# Altium project BEE-DAL_EXP_V1.0.PrjPcb (part 2 of 2)

## Sheet 15_HD_PUMP.SchDoc
size 420 x 297 mm; SheetNumber: 15; SheetTotal: 27
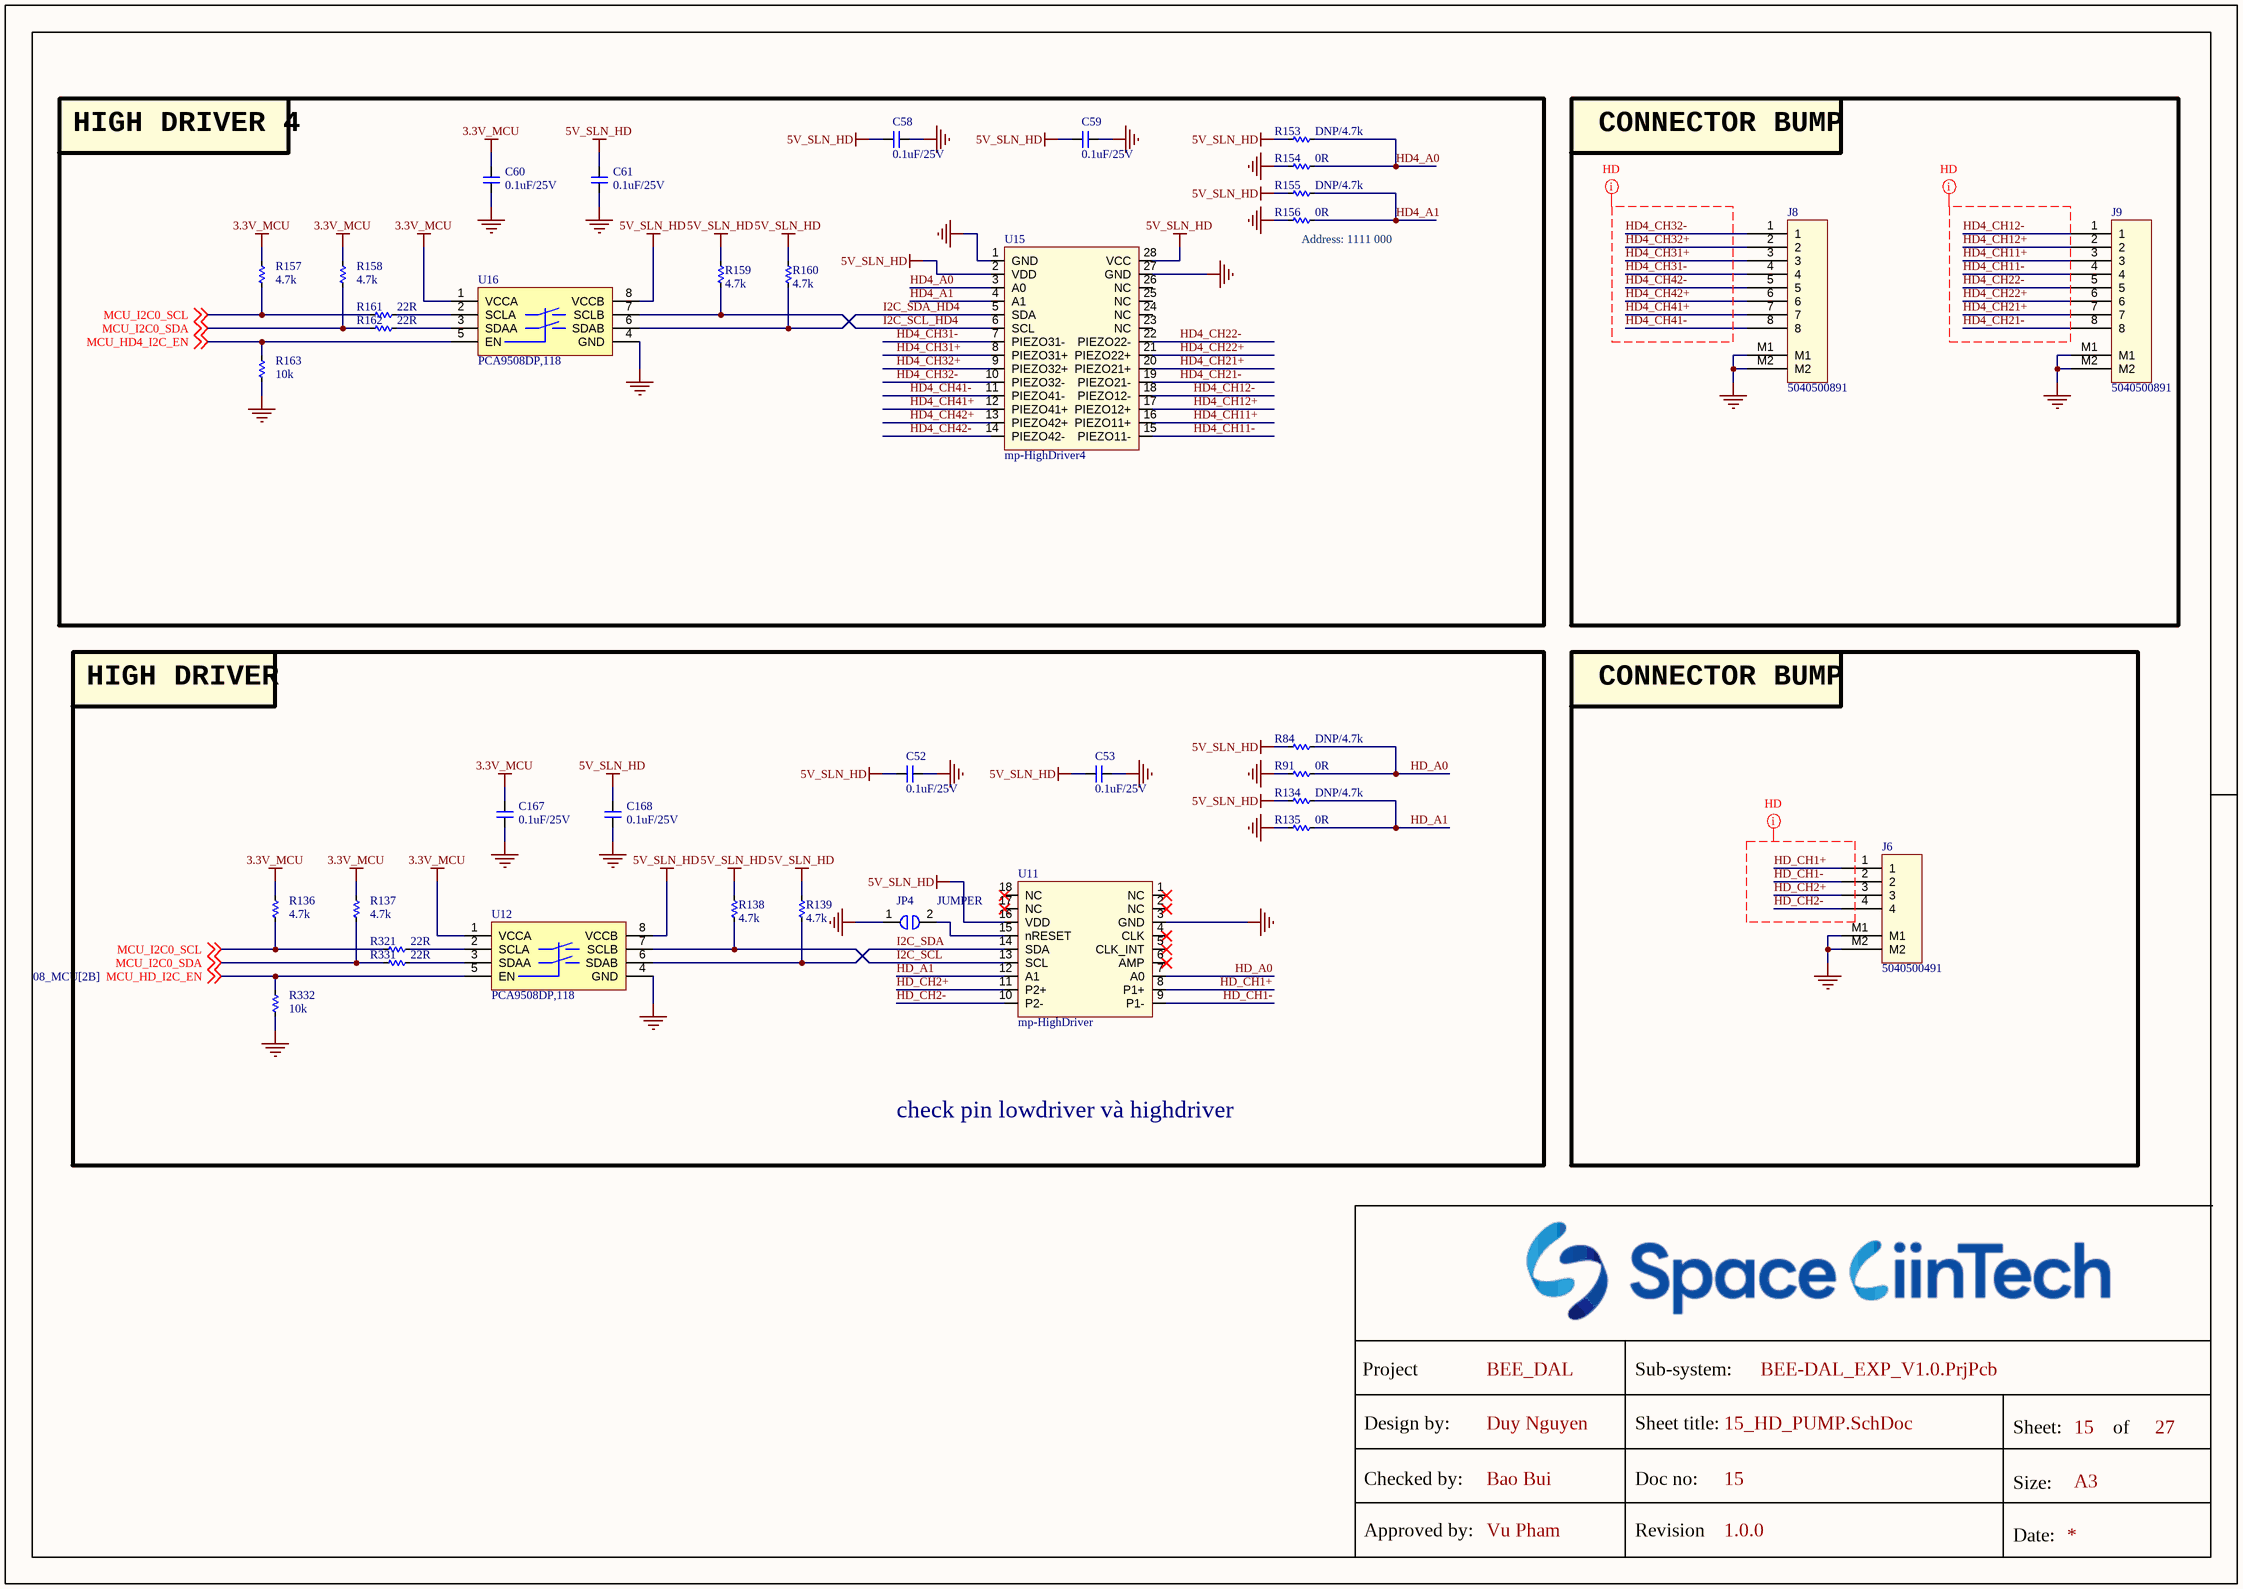
[diagram p18: 15_HD_PUMP.SchDoc]

### Parts
C52  0.1uF/25V  [CAP_C_1005X60]
C53  0.1uF/25V  [CAP_C_1005X60]
C58  0.1uF/25V  [CAP_C_1005X60]
C59  0.1uF/25V  [CAP_C_1005X60]
C60  0.1uF/25V  [CAP_C_1005X60]
C61  0.1uF/25V  [CAP_C_1005X60]
C167  0.1uF/25V  [CAP_C_1005X60]
C168  0.1uF/25V  [CAP_C_1005X60]
J6  5040500491  [MOLEX_5040500491]
J8  5040500891  [MOLEX_5040500891]
J9  5040500891  [MOLEX_5040500891]
JP4  JUMPER  [JUMPER_1608]
R84  DNP/4.7k  [RES_C_1005X40]
R91  0R  [RES_C_1005X40]
R134  DNP/4.7k  [RES_C_1005X40]
R135  0R  [RES_C_1005X40]
R136  4.7k  [RES_C_1005X40]
R137  4.7k  [RES_C_1005X40]
R138  4.7k  [RES_C_1005X40]
R139  4.7k  [RES_C_1005X40]
R153  DNP/4.7k  [RES_C_1005X40]
R154  0R  [RES_C_1005X40]
R155  DNP/4.7k  [RES_C_1005X40]
R156  0R  [RES_C_1005X40]
R157  4.7k  [RES_C_1005X40]
R158  4.7k  [RES_C_1005X40]
R159  4.7k  [RES_C_1005X40]
R160  4.7k  [RES_C_1005X40]
R161  22R  [RES_C_1005X40]
R162  22R  [RES_C_1005X40]
R163  10k  [RES_C_1005X40]
R321  22R  [RES_C_1005X40]
R331  22R  [RES_C_1005X40]
R332  10k  [RES_C_1005X40]
U11  mp-HighDriver  [MP_HIGHDRIVER]
U12  PCA9508DP,118  [TSOP8]
U15  mp-HighDriver4  [MP_HIGHDRIVER4]
U16  PCA9508DP,118  [TSOP8]

### Blocks framed on the sheet
HIGH DRIVER 4: C58-C61 R153-R163 U15 U16
CONNECTOR BUMP: J8 J9
HIGH DRIVER: C52 C53 C167 C168 JP4 R84 R91 R134-R139 R321 R331 R332 U11 U12
CONNECTOR BUMP: J6

### Nets
3.3V_MCU: C60.2 C167.2 R136.1 R137.1 R157.1 R158.1 U12.1(VCCA) U16.1(VCCA)
5V_SLN_HD: C52.2 C53.2 C58.2 C59.2 C61.2 C168.2 R84.1 R134.1 R138.1 R139.1 R153.1 R155.1 R159.1 R160.1 U11.16(VDD) U12.8(VCCB) U15.2(VDD) U15.28(VCC) U16.8(VCCB)
GND: C52.1 C53.1 C58.1 C59.1 C60.1 C61.1 C167.1 C168.1 J6.M1 J6.M2 J8.M1 J8.M2 J9.M1 J9.M2 JP4.1 R91.1 R135.1 R154.1 R156.1 R163.2 R332.2 U11.3(GND) U12.4(GND) U15.1(GND) U15.27(GND) U16.4(GND)
HD4_A0: R153.2 R154.2 U15.3(A0)
HD4_A1: R155.2 R156.2 U15.4(A1)
HD4_CH11+: J9.3 U15.16(PIEZO11+)
HD4_CH11-: J9.4 U15.15(PIEZO11-)
HD4_CH12+: J9.2 U15.17(PIEZO12+)
HD4_CH12-: J9.1 U15.18(PIEZO12-)
HD4_CH21+: J9.7 U15.20(PIEZO21+)
HD4_CH21-: J9.8 U15.19(PIEZO21-)
HD4_CH22+: J9.6 U15.21(PIEZO22+)
HD4_CH22-: J9.5 U15.22(PIEZO22-)
HD4_CH31+: J8.3 U15.8(PIEZO31+)
HD4_CH31-: J8.4 U15.7(PIEZO31-)
HD4_CH32+: J8.2 U15.9(PIEZO32+)
HD4_CH32-: J8.1 U15.10(PIEZO32-)
HD4_CH41+: J8.7 U15.12(PIEZO41+)
HD4_CH41-: J8.8 U15.11(PIEZO41-)
HD4_CH42+: J8.6 U15.13(PIEZO42+)
HD4_CH42-: J8.5 U15.14(PIEZO42-)
HD_A0: R84.2 R91.2 U11.7(A0)
HD_A1: R134.2 R135.2 U11.12(A1)
HD_CH1+: J6.1 U11.8(P1+)
HD_CH1-: J6.2 U11.9(P1-)
HD_CH2+: J6.3 U11.11(P2+)
HD_CH2-: J6.4 U11.10(P2-)
I2C_SCL: R138.2 U11.13(SCL) U12.7(SCLB)
I2C_SCL_HD4: R159.2 U15.6(SCL) U16.7(SCLB)
I2C_SDA: R139.2 U11.14(SDA) U12.6(SDAB)
I2C_SDA_HD4: R160.2 U15.5(SDA) U16.6(SDAB)
MCU_HD4_I2C_EN: R163.1 U16.5(EN) ; off-sheet MCU_HD4_I2C_EN
MCU_HD_I2C_EN: R332.1 U12.5(EN) ; off-sheet MCU_HD_I2C_EN
MCU_I2C0_SCL: R136.2 R157.2 R161.1 R321.1 ; off-sheet MCU_I2C0_SCL
MCU_I2C0_SDA: R137.2 R158.2 R162.1 R331.1 ; off-sheet MCU_I2C0_SDA
NetJP4_2: JP4.2 U11.15(nRESET)
NetR161_2: R161.2 U16.2(SCLA)
NetR162_2: R162.2 U16.3(SDAA)
NetR321_2: R321.2 U12.2(SCLA)
NetR331_2: R331.2 U12.3(SDAA)

Not connected (* = marked no-connect by the designer): U11 1(NC)* 2(NC)* 4(CLK)* 5(CLK_INT)* 6(AMP)* 17(NC)* 18(NC)*; U15 23(NC) 24(NC) 25(NC) 26(NC)

### Layout directives
net class HD: HD4_CH11+, HD4_CH11-, HD4_CH12+, HD4_CH12-, HD4_CH21+, HD4_CH21-, HD4_CH22+, HD4_CH22-, HD4_CH31+, HD4_CH31-, HD4_CH32+, HD4_CH32-, HD4_CH41+, HD4_CH41-, HD4_CH42+, HD4_CH42-, HD_CH1+, HD_CH1-, HD_CH2+, HD_CH2-

### Notes on the sheet
- (near R156) Address: 1111 000
- check pin lowdriver và highdriver
- Project
- Sub-system:
- Design by:
- Sheet title:
- Sheet:
- of
- Checked by:
- Approved by:
- Doc no:
- Revision
- Size:
- Date:

### Library data of the parts
C52 C53 C58-C61 C167 C168 = _CAP_C_2: CAP
J6 = Header 4x1_2M
J8 J9 = Header 8x1_2M
JP4 = JUMPER_1_1
R84 R91 R134-R139 R153-R163 R321 R331 R332 = _RES_B_2: RES
U15 = mp_HighDriver4

## Sheet 16_SOLENOID_HB_1.SchDoc
size 420 x 297 mm; SheetNumber: 16; SheetTotal: 27
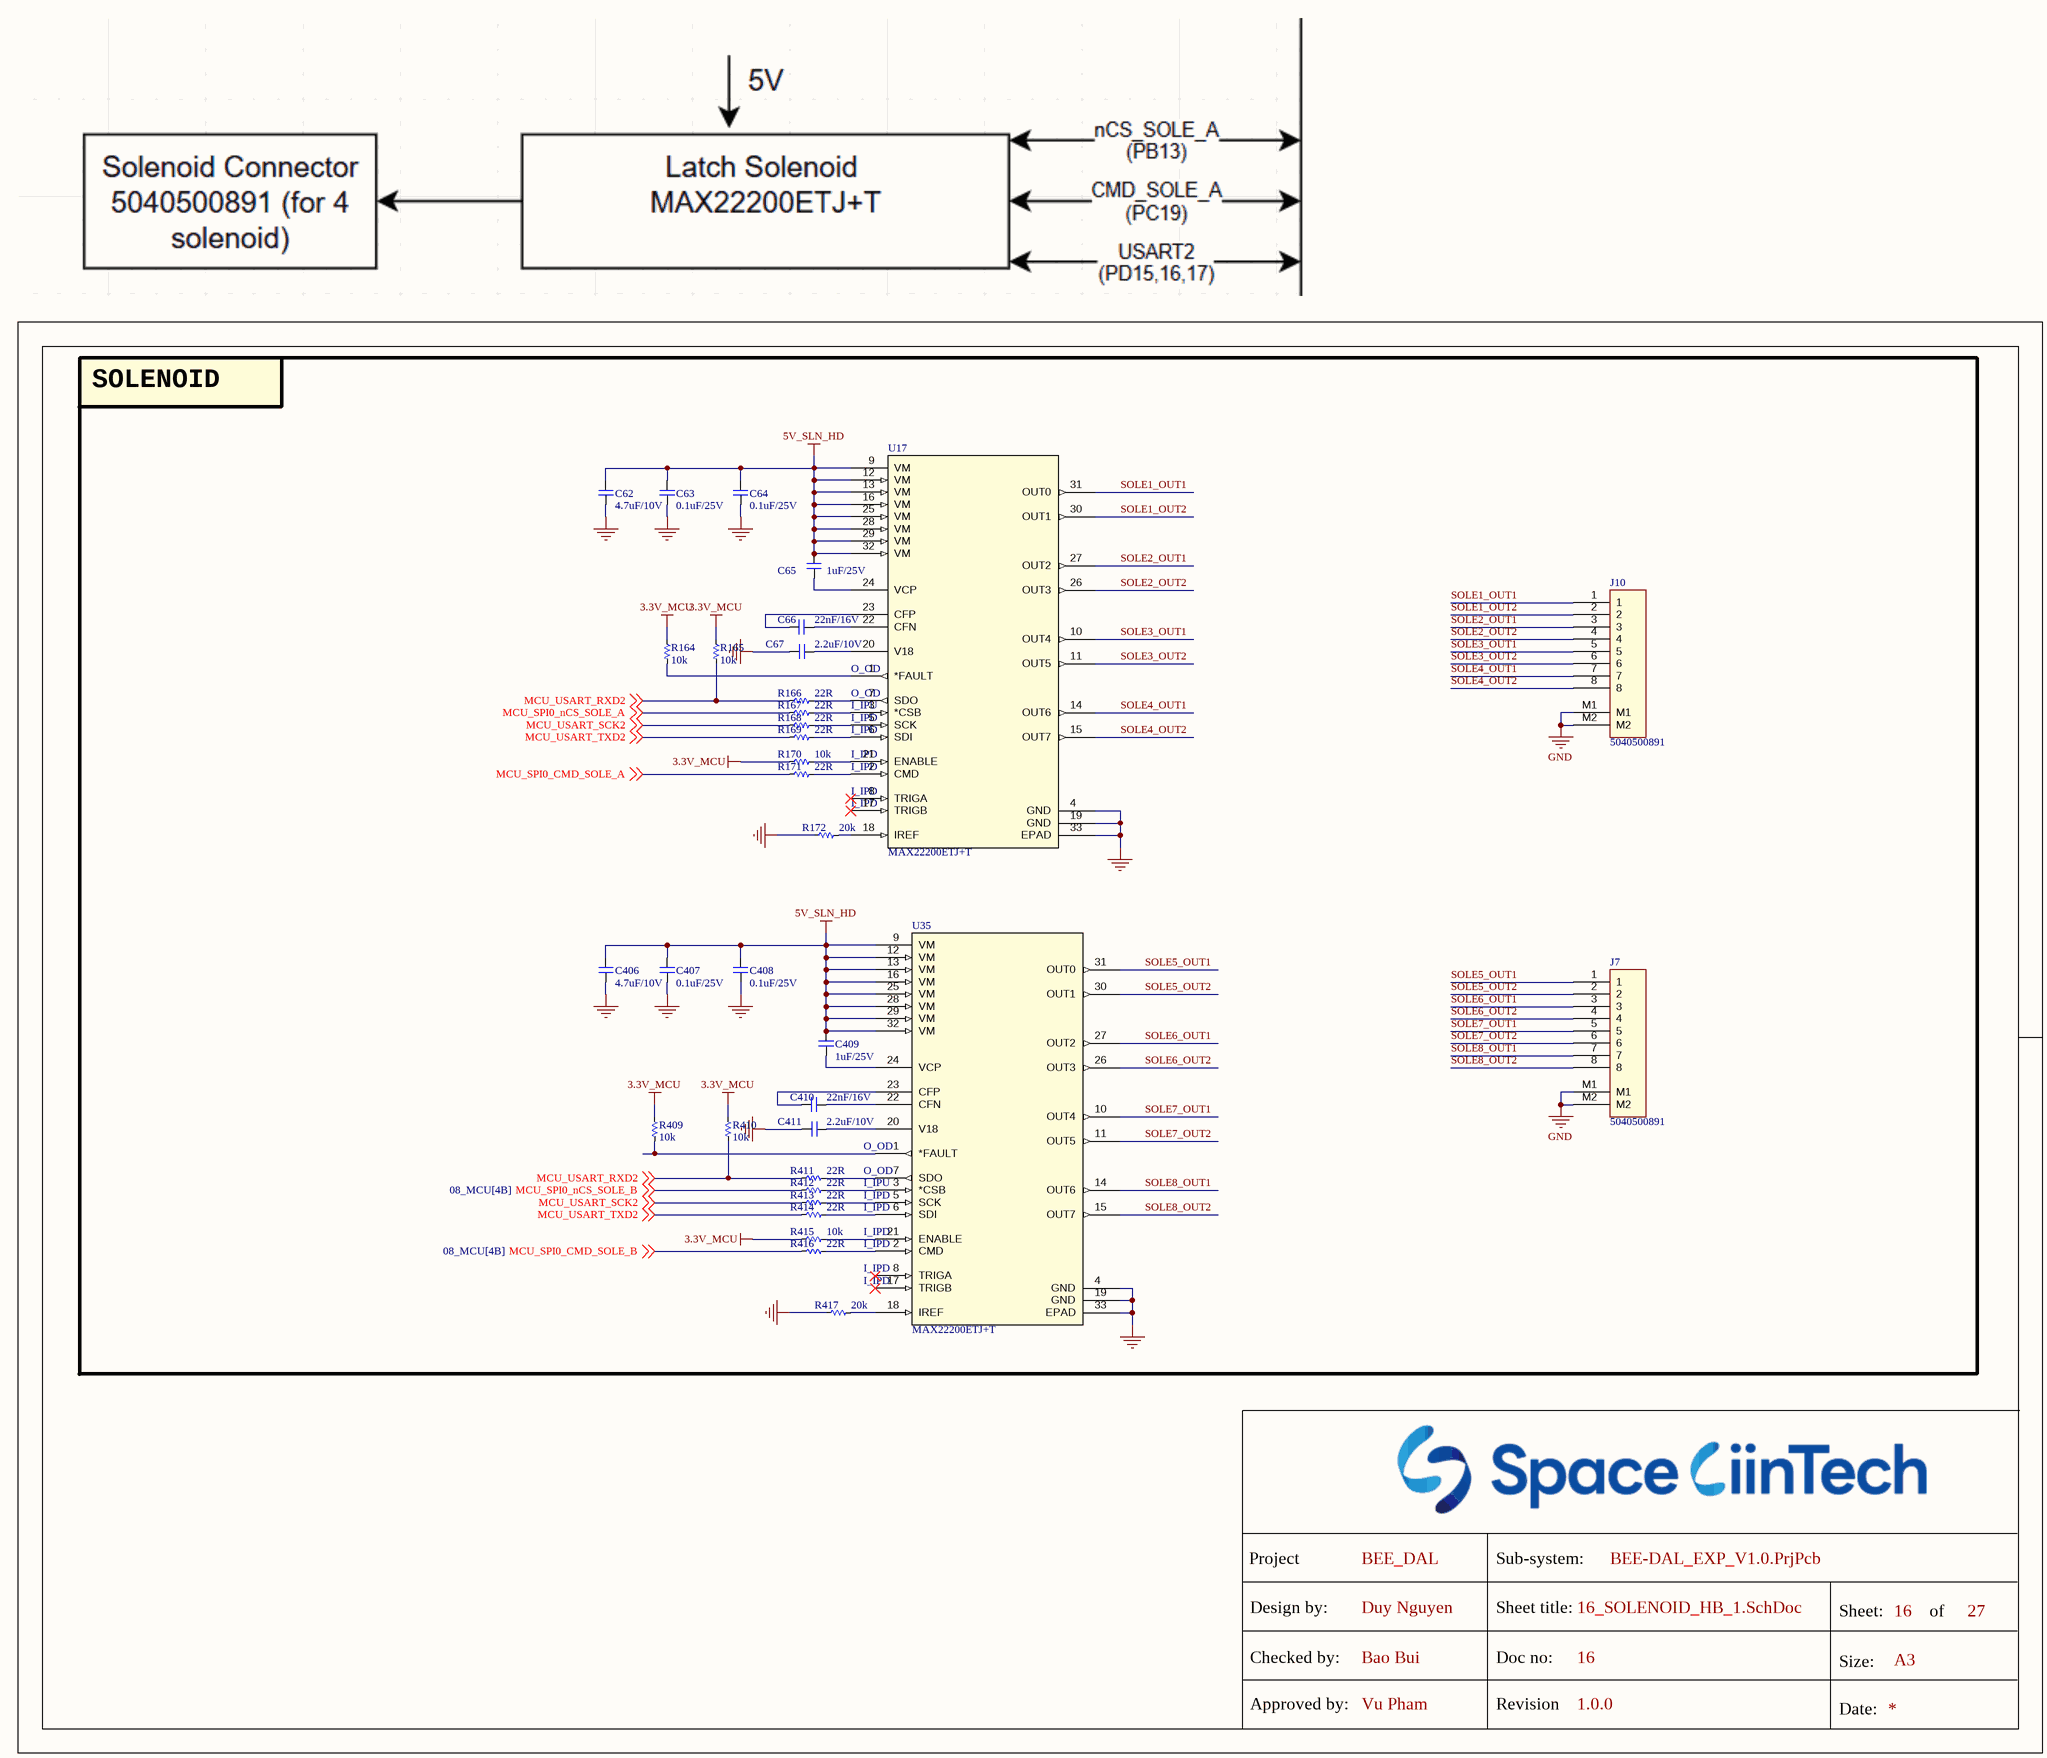
[diagram p19: 16_SOLENOID_HB_1.SchDoc]

### Parts
C62  4.7uF/10V  [CAP_C_1005X60]
C63  0.1uF/25V  [CAP_C_1005X60]
C64  0.1uF/25V  [CAP_C_1005X60]
C65  1uF/25V  [CAP_C_1005X60]
C66  22nF/16V  [CAP_C_1005X60]
C67  2.2uF/10V  [CAP_C_1005X60]
C406  4.7uF/10V  [CAP_C_1005X60]
C407  0.1uF/25V  [CAP_C_1005X60]
C408  0.1uF/25V  [CAP_C_1005X60]
C409  1uF/25V  [CAP_C_1005X60]
C410  22nF/16V  [CAP_C_1005X60]
C411  2.2uF/10V  [CAP_C_1005X60]
J7  5040500891  [MOLEX_5040500891]
J10  5040500891  [MOLEX_5040500891]
R164  10k  [RES_C_1005X40]
R165  10k  [RES_C_1005X40]
R166  22R  [RES_C_1005X40]
R167  22R  [RES_C_1005X40]
R168  22R  [RES_C_1005X40]
R169  22R  [RES_C_1005X40]
R170  10k  [RES_C_1005X40]
R171  22R  [RES_C_1005X40]
R172  20k  [RES_C_1005X40]
R409  10k  [RES_C_1005X40]
R410  10k  [RES_C_1005X40]
R411  22R  [RES_C_1005X40]
R412  22R  [RES_C_1005X40]
R413  22R  [RES_C_1005X40]
R414  22R  [RES_C_1005X40]
R415  10k  [RES_C_1005X40]
R416  22R  [RES_C_1005X40]
R417  20k  [RES_C_1005X40]
U17  MAX22200ETJ+T  [21-0140AK_T3255_8C_MXM]
U35  MAX22200ETJ+T  [21-0140AK_T3255_8C_MXM]

### Nets
3.3V_MCU: R164.1 R165.1 R170.1 R409.1 R410.1 R415.1
5V_SLN_HD: C62.2 C63.2 C64.2 C65.2 C406.2 C407.2 C408.2 C409.2 U17.9(VM) U17.12(VM) U17.13(VM) U17.16(VM) U17.25(VM) U17.28(VM) U17.29(VM) U17.32(VM) U35.9(VM) U35.12(VM) U35.13(VM) U35.16(VM) U35.25(VM) U35.28(VM) U35.29(VM) U35.32(VM)
GND: C62.1 C63.1 C64.1 C67.1 C406.1 C407.1 C408.1 C411.1 J7.M1 J7.M2 J10.M1 J10.M2 R172.1 R417.1 U17.4(GND) U17.19(GND) U17.33(EPAD) U35.4(GND) U35.19(GND) U35.33(EPAD)
MCU_SPI0_CMD_SOLE_A: R171.1 ; off-sheet MCU_SPI0_CMD_SOLE_A
MCU_SPI0_CMD_SOLE_B: R416.1 ; off-sheet MCU_SPI0_CMD_SOLE_B
MCU_SPI0_nCS_SOLE_A: R167.1 ; off-sheet MCU_SPI0_nCS_SOLE_A
MCU_SPI0_nCS_SOLE_B: R412.1 ; off-sheet MCU_SPI0_nCS_SOLE_B
MCU_USART_RXD2: R165.2 R166.1 R410.2 R411.1 ; off-sheet MCU_USART_RXD2
MCU_USART_SCK2: R168.1 R413.1 ; off-sheet MCU_USART_SCK2
MCU_USART_TXD2: R169.1 R414.1 ; off-sheet MCU_USART_TXD2
SOLE1_OUT1: J10.1 U17.31(OUT0)
SOLE1_OUT2: J10.2 U17.30(OUT1)
SOLE2_OUT1: J10.3 U17.27(OUT2)
SOLE2_OUT2: J10.4 U17.26(OUT3)
SOLE3_OUT1: J10.5 U17.10(OUT4)
SOLE3_OUT2: J10.6 U17.11(OUT5)
SOLE4_OUT1: J10.7 U17.14(OUT6)
SOLE4_OUT2: J10.8 U17.15(OUT7)
SOLE5_OUT1: J7.1 U35.31(OUT0)
SOLE5_OUT2: J7.2 U35.30(OUT1)
SOLE6_OUT1: J7.3 U35.27(OUT2)
SOLE6_OUT2: J7.4 U35.26(OUT3)
SOLE7_OUT1: J7.5 U35.10(OUT4)
SOLE7_OUT2: J7.6 U35.11(OUT5)
SOLE8_OUT1: J7.7 U35.14(OUT6)
SOLE8_OUT2: J7.8 U35.15(OUT7)
NetC65_1: C65.1 U17.24(VCP)
NetC66_1: C66.1 U17.22(CFN)
NetC66_2: C66.2 U17.23(CFP)
NetC67_2: C67.2 U17.20(V18)
NetC409_1: C409.1 U35.24(VCP)
NetC410_1: C410.1 U35.22(CFN)
NetC410_2: C410.2 U35.23(CFP)
NetC411_2: C411.2 U35.20(V18)
NetR164_2: R164.2 U17.1(*FAULT)
NetR166_2: R166.2 U17.7(SDO)
NetR167_2: R167.2 U17.3(*CSB)
NetR168_2: R168.2 U17.5(SCK)
NetR169_2: R169.2 U17.6(SDI)
NetR170_2: R170.2 U17.21(ENABLE)
NetR171_2: R171.2 U17.2(CMD)
NetR172_2: R172.2 U17.18(IREF)
NetR409_2: R409.2 U35.1(*FAULT)
NetR411_2: R411.2 U35.7(SDO)
NetR412_2: R412.2 U35.3(*CSB)
NetR413_2: R413.2 U35.5(SCK)
NetR414_2: R414.2 U35.6(SDI)
NetR415_2: R415.2 U35.21(ENABLE)
NetR416_2: R416.2 U35.2(CMD)
NetR417_2: R417.2 U35.18(IREF)

Not connected (* = marked no-connect by the designer): U17 8(TRIGA)* 17(TRIGB)*; U35 8(TRIGA)* 17(TRIGB)*

### Notes on the sheet
- SOLENOID
- (near U17) O_OD
- (near U17) I_IPU
- (near U17) I_IPD
- (near U35) O_OD
- O_OD
- (near U35) I_IPU
- (near U35) I_IPD
- I_IPD
- Project
- Sub-system:
- Design by:
- Sheet title:
- Sheet:
- of
- Checked by:
- Approved by:
- Doc no:
- Revision
- Size:
- Date:

### Library data of the parts
C62-C65 C67 C406-C409 C411 = _CAP_C_2: CAP
C66 C410 = _CAP_C_2: CAP CHIP
J7 J10 = Header 8x1_2M
R164-R172 R409-R417 = _RES_B_2: RES
U17 U35 = MAX22200ETJ+T: 36V, 1A Octal Integrated Serial-Controlled Solenoid and Motor Driver; Manufacturer_Name: Analog Devices Inc; Copyright: Copyright (C) 2026 Ultra Librarian. All rights reserved.; Manufacturer_Part_Number: MAX22200ETJ+T; RefDes: RefDes; Type: Type

## Sheet 17_CAM_CONNECTOR.SchDoc
size 420 x 297 mm; SheetNumber: 17; SheetTotal: 27
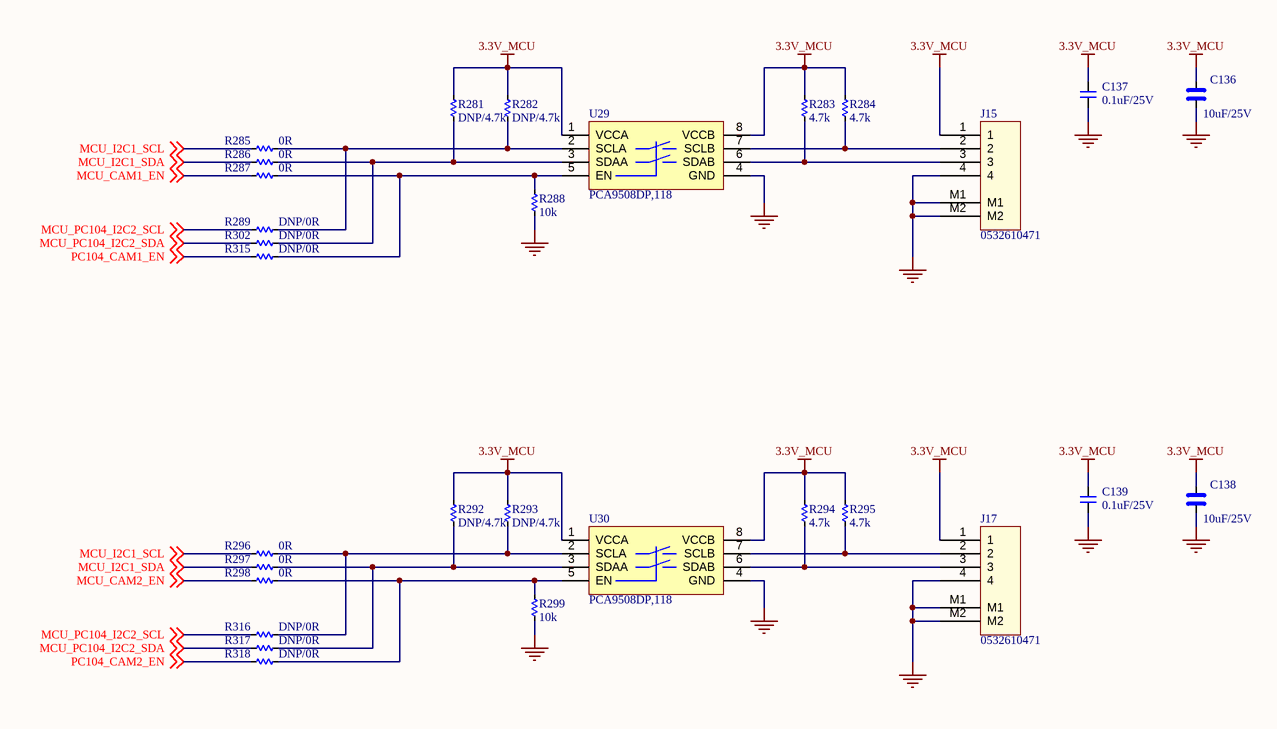
[diagram p20: 17_CAM_CONNECTOR.SchDoc]

### Parts
C136  10uF/25V  [CAP_C_2012X110]
C137  0.1uF/25V  [CAP_C_1005X60]
C138  10uF/25V  [CAP_C_2012X110]
C139  0.1uF/25V  [CAP_C_1005X60]
J15  0532610471  [MOLEX_0532610471]
J17  0532610471  [MOLEX_0532610471]
R281  DNP/4.7k  [RES_C_1005X40]
R282  DNP/4.7k  [RES_C_1005X40]
R283  4.7k  [RES_C_1005X40]
R284  4.7k  [RES_C_1005X40]
R285  0R  [RES_C_1005X40]
R286  0R  [RES_C_1005X40]
R287  0R  [RES_C_1005X40]
R288  10k  [RES_C_1005X40]
R289  DNP/0R  [RES_C_1005X40]
R292  DNP/4.7k  [RES_C_1005X40]
R293  DNP/4.7k  [RES_C_1005X40]
R294  4.7k  [RES_C_1005X40]
R295  4.7k  [RES_C_1005X40]
R296  0R  [RES_C_1005X40]
R297  0R  [RES_C_1005X40]
R298  0R  [RES_C_1005X40]
R299  10k  [RES_C_1005X40]
R302  DNP/0R  [RES_C_1005X40]
R315  DNP/0R  [RES_C_1005X40]
R316  DNP/0R  [RES_C_1005X40]
R317  DNP/0R  [RES_C_1005X40]
R318  DNP/0R  [RES_C_1005X40]
U29  PCA9508DP,118  [TSOP8]
U30  PCA9508DP,118  [TSOP8]

### Nets
3.3V_MCU: C136.1 C137.2 C138.1 C139.2 J15.1 J17.1 R281.1 R282.1 R283.1 R284.1 R292.1 R293.1 R294.1 R295.1 U29.1(VCCA) U29.8(VCCB) U30.1(VCCA) U30.8(VCCB)
GND: C136.2 C137.1 C138.2 C139.1 J15.4 J15.M1 J15.M2 J17.4 J17.M1 J17.M2 R288.2 R299.2 U29.4(GND) U30.4(GND)
MCU_CAM1_EN: R287.1 ; off-sheet MCU_CAM1_EN
MCU_CAM2_EN: R298.1 ; off-sheet MCU_CAM2_EN
MCU_I2C1_SCL: R285.1 R296.1 ; off-sheet MCU_I2C1_SCL
MCU_I2C1_SDA: R286.1 R297.1 ; off-sheet MCU_I2C1_SDA
MCU_PC104_I2C2_SCL: R289.1 R316.1 ; off-sheet MCU_PC104_I2C2_SCL
MCU_PC104_I2C2_SDA: R302.1 R317.1 ; off-sheet MCU_PC104_I2C2_SDA
PC104_CAM1_EN: R315.1 ; off-sheet PC104_CAM1_EN
PC104_CAM2_EN: R318.1 ; off-sheet PC104_CAM2_EN
NetJ15_2: J15.2 R284.2 U29.7(SCLB)
NetJ15_3: J15.3 R283.2 U29.6(SDAB)
NetJ17_2: J17.2 R295.2 U30.7(SCLB)
NetJ17_3: J17.3 R294.2 U30.6(SDAB)
NetR281_2: R281.2 R286.2 R302.2 U29.3(SDAA)
NetR282_2: R282.2 R285.2 R289.2 U29.2(SCLA)
NetR287_2: R287.2 R288.1 R315.2 U29.5(EN)
NetR292_2: R292.2 R297.2 R317.2 U30.3(SDAA)
NetR293_2: R293.2 R296.2 R316.2 U30.2(SCLA)
NetR298_2: R298.2 R299.1 R318.2 U30.5(EN)

### Notes on the sheet
- Project
- Sub-system:
- Design by:
- Sheet title:
- Sheet:
- of
- Checked by:
- Approved by:
- Doc no:
- Revision
- Size:
- Date:

### Library data of the parts
C136 C138 = _CAP_C_High_2: CAP High Value
C137 C139 = _CAP_C_2: CAP
J15 J17 = Header 4x1_2M_1
R281-R289 R292-R299 R302 R315-R318 = _RES_B_2: RES

## Sheet 18_IR_LED.SchDoc
size 420 x 297 mm; SheetNumber: 18; SheetTotal: 27
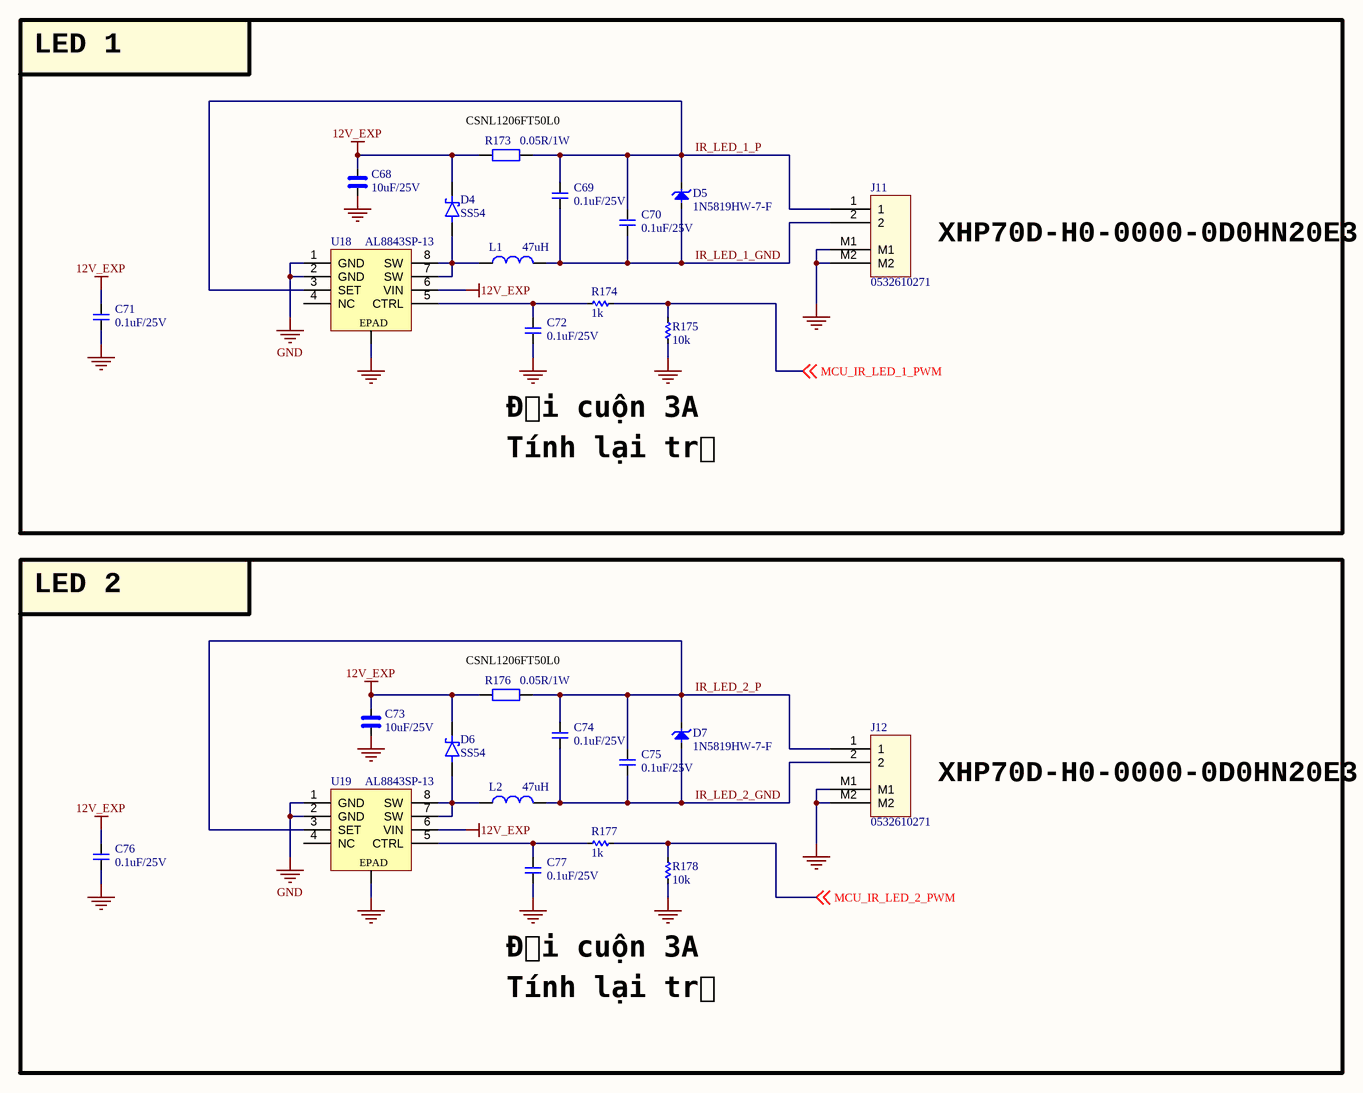
[diagram p21: 18_IR_LED.SchDoc]

### Parts
C68  10uF/25V  [CAP_C_2012X110]
C69  0.1uF/25V  [CAP_C_1608X80]
C70  0.1uF/25V  [CAP_C_1608X80]
C71  0.1uF/25V  [CAP_C_1608X80]
C72  0.1uF/25V  [CAP_C_1608X80]
C73  10uF/25V  [CAP_C_2012X110]
C74  0.1uF/25V  [CAP_C_1608X80]
C75  0.1uF/25V  [CAP_C_1608X80]
C76  0.1uF/25V  [CAP_C_1608X80]
C77  0.1uF/25V  [CAP_C_1608X80]
D4  SS54  [DO-214AC_SMA]
D5  1N5819HW-7-F  [SOD3717X145N]
D6  SS54  [DO-214AC_SMA]
D7  1N5819HW-7-F  [SOD3717X145N]
J11  0532610271  [MOLEX_0532610271]
J12  0532610271  [MOLEX_0532610271]
L1  47uH  [IND_MP_1250x1250x850]
L2  47uH  [IND_MP_1250x1250x850]
R173  0.05R/1W  [RES_C_3216X70]
R174  1k  [RES_C_1608X60]
R175  10k  [RES_C_1608X60]
R176  0.05R/1W  [RES_C_3216X70]
R177  1k  [RES_C_1608X60]
R178  10k  [RES_C_1608X60]
U18  AL8843SP-13  [SOIC127P602X173-8N_EPAD]
U19  AL8843SP-13  [SOIC127P602X173-8N_EPAD]

### Nets
12V_EXP: C68.1 C71.2 C73.1 C76.2 D4.1(K) D6.1(K) R173.1 R176.1 U18.6(VIN) U19.6(VIN)
GND: C68.2 C71.1 C72.1 C73.2 C76.1 C77.1 J11.M1 J11.M2 J12.M1 J12.M2 R175.2 R178.2 U18.1(GND) U18.2(GND) U18.9(EPAD) U19.1(GND) U19.2(GND) U19.9(EPAD)
IR_LED_1_GND: C69.1 C70.1 D5.2(A) J11.2 L1.2
IR_LED_1_P: C69.2 C70.2 D5.1(K) J11.1 R173.2 U18.3(SET)
IR_LED_2_GND: C74.1 C75.1 D7.2(A) J12.2 L2.2
IR_LED_2_P: C74.2 C75.2 D7.1(K) J12.1 R176.2 U19.3(SET)
MCU_IR_LED_1_PWM: R174.2 R175.1 ; off-sheet MCU_IR_LED_1_PWM
MCU_IR_LED_2_PWM: R177.2 R178.1 ; off-sheet MCU_IR_LED_2_PWM
NetC72_2: C72.2 R174.1 U18.5(CTRL)
NetC77_2: C77.2 R177.1 U19.5(CTRL)
NetD4_2: D4.2(A) L1.1 U18.7(SW) U18.8(SW)
NetD6_2: D6.2(A) L2.1 U19.7(SW) U19.8(SW)

Not connected (* = marked no-connect by the designer): U18 4(NC); U19 4(NC)

### Notes on the sheet
- LED 1
- (near R173) CSNL1206FT50L0
- XHP70D-H0-0000-0D0HN20E3
- Đổi cuộn 3A
- Tính lại trở
- LED 2
- (near R176) CSNL1206FT50L0
- Project
- Sub-system:
- Design by:
- Sheet title:
- Sheet:
- of
- Checked by:
- Approved by:
- Doc no:
- Revision
- Size:
- Date:

### Library data of the parts
C68 C73 = _CAP_C_High_2: CAP High Value
C69-C72 C74-C77 = _CAP_C_2: CAP
D4 D6 = DIODE SCHOTTKY
D5 D7 = DIODE Zener: Zenner
J11 J12 = Header 2x1_2M
L1 L2 = L-SMD-1: B82477P4473M000; partNo: 78477010; Manufacturer: Wurth Elektronik; Inductance: 1.0 μH; ComponentLink1Description: Manufacturer; ComponentLink1URL: http://www.we-online.de; Created by: Baojun Chen; Created Date: Nov.2015; ComponentLink2Description: Datasheet; ComponentLink2URL: http://katalog.we-online.de/pbs/datasheet/78477010.pdf
R173 R176 = _RES: RES; Chung_Loai: Dán; Don_Vi: Con; So_Chan: 2; Ten_Linh_Kien: Trở 0603 1% 10k; Ma_Hang: MH006333; Kieu_Chan: *
R174 R175 R177 R178 = _RES_B_2: RES
U18 U19 = AL8843SP-13: IC LED DRIVER RGLTR PWM 3A 8SO

## Sheet HEATER.SchDoc
size 420 x 297 mm; SheetNumber: 19; SheetTotal: 27
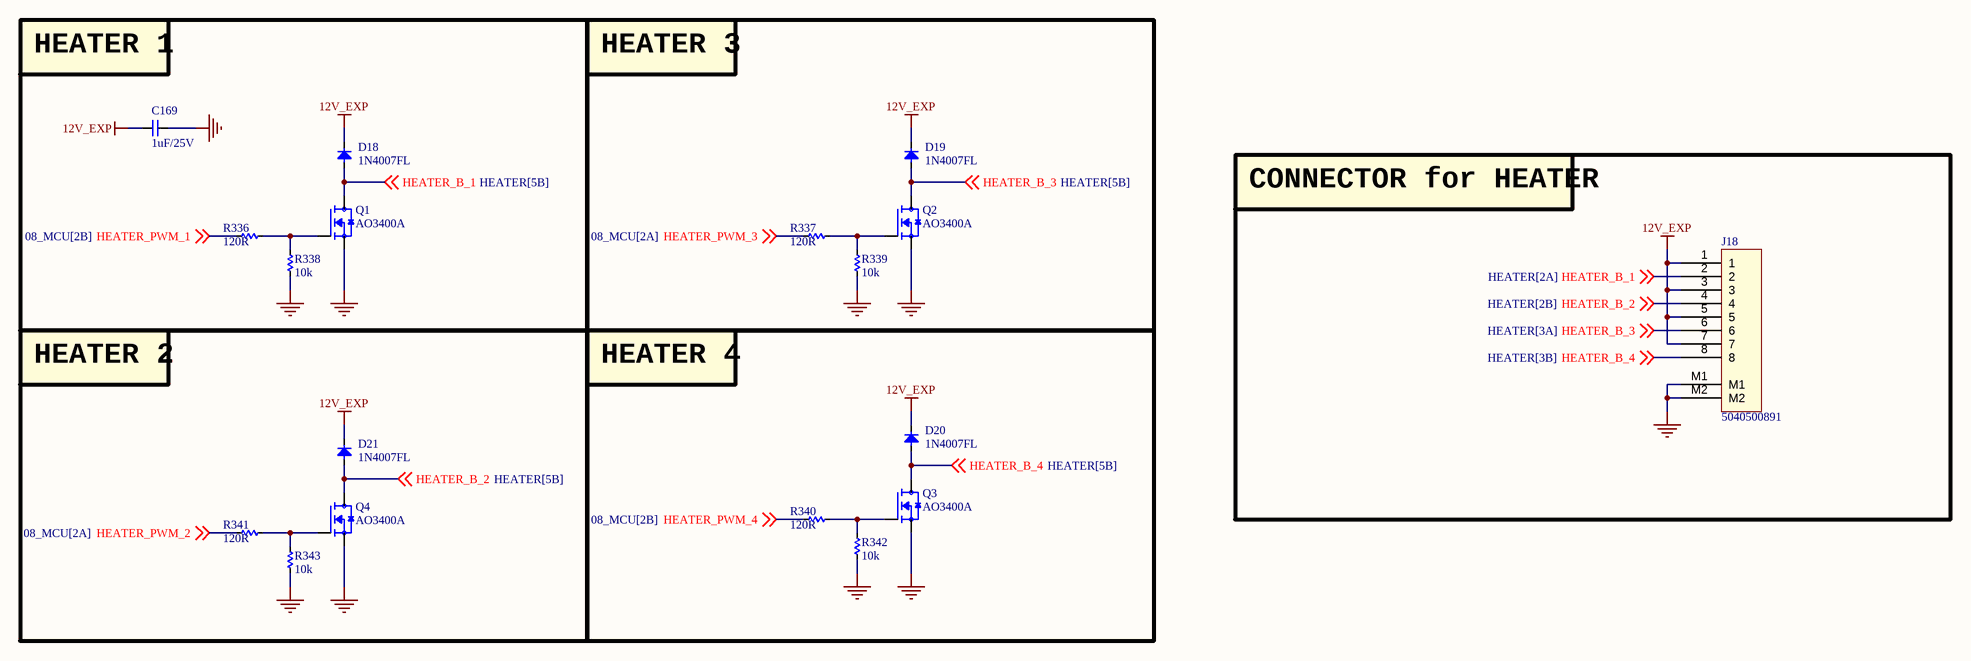
[diagram p22: HEATER.SchDoc]

### Parts
C169  1uF/25V  [CAP_C_1005X60]
D18  1N4007FL  [SOD3717X145N]
D19  1N4007FL  [SOD3717X145N]
D20  1N4007FL  [SOD3717X145N]
D21  1N4007FL  [SOD3717X145N]
J18  5040500891  [MOLEX_5040500891]
Q1  AO3400A  [SOT95P240X120-3N]
Q2  AO3400A  [SOT95P240X120-3N]
Q3  AO3400A  [SOT95P240X120-3N]
Q4  AO3400A  [SOT95P240X120-3N]
R336  120R  [RES_C_1005X40]
R337  120R  [RES_C_1005X40]
R338  10k  [RES_C_1005X40]
R339  10k  [RES_C_1005X40]
R340  120R  [RES_C_1005X40]
R341  120R  [RES_C_1005X40]
R342  10k  [RES_C_1005X40]
R343  10k  [RES_C_1005X40]

### Blocks framed on the sheet
HEATER 1: C169 D18 Q1 R336 R338
HEATER 3: D19 Q2 R337 R339
CONNECTOR for HEATER: J18
HEATER 2: D21 Q4 R341 R343
HEATER 4: D20 Q3 R340 R342

### Nets
12V_EXP: C169.2 D18.1(K) D19.1(K) D20.1(K) D21.1(K) J18.1 J18.3 J18.5 J18.7
GND: C169.1 J18.M1 J18.M2 Q1.2(S) Q2.2(S) Q3.2(S) Q4.2(S) R338.1 R339.1 R342.1 R343.1
HEATER_B_1: D18.2(A) J18.2 Q1.3(D) ; off-sheet HEATER_B_1
HEATER_B_2: D21.2(A) J18.4 Q4.3(D) ; off-sheet HEATER_B_2
HEATER_B_3: D19.2(A) J18.6 Q2.3(D) ; off-sheet HEATER_B_3
HEATER_B_4: D20.2(A) J18.8 Q3.3(D) ; off-sheet HEATER_B_4
HEATER_PWM_1: R336.1 ; off-sheet HEATER_PWM_1
HEATER_PWM_2: R341.1 ; off-sheet HEATER_PWM_2
HEATER_PWM_3: R337.1 ; off-sheet HEATER_PWM_3
HEATER_PWM_4: R340.1 ; off-sheet HEATER_PWM_4
NetQ1_1: Q1.1(G) R336.2 R338.2
NetQ2_1: Q2.1(G) R337.2 R339.2
NetQ3_1: Q3.1(G) R340.2 R342.2
NetQ4_1: Q4.1(G) R341.2 R343.2

### Notes on the sheet
- Project
- Sub-system:
- Design by:
- Sheet title:
- Sheet:
- of
- Checked by:
- Approved by:
- Doc no:
- Revision
- Size:
- Date:

### Library data of the parts
C169 = _CAP_C_2: CAP
D18-D21 = Diode SMD: Default Diode; Code - JEDEC: DO-214-AB; Value: 1N5007; Published: 8-Jun-2000; Revision: July-2002: Re-released for DXP Platform.; Publisher: Altium Limited
J18 = Header 8x1_2M
Q1-Q4 = MOSFET_N: N-Channel 30 V 5.7A (Ta) 1.4W (Ta) Surface Mount SOT-23-3; MF: Alpha & Omega Semiconductor; SnapEDA_Link: https://www.snapeda.com/parts/AO3400A/Alpha/view-part/?ref=snap; Package: SOT-23 Alpha &amp; Omega Semiconductor Inc.; Value: *; MP: AO3400A; Check_prices: https://www.snapeda.com/parts/AO3400A/Alpha/view-part/?ref=eda
R336-R343 = _RES_B_2: RES

## Sheet NTC.SchDoc
size 420 x 297 mm; SheetNumber: 20; SheetTotal: 27
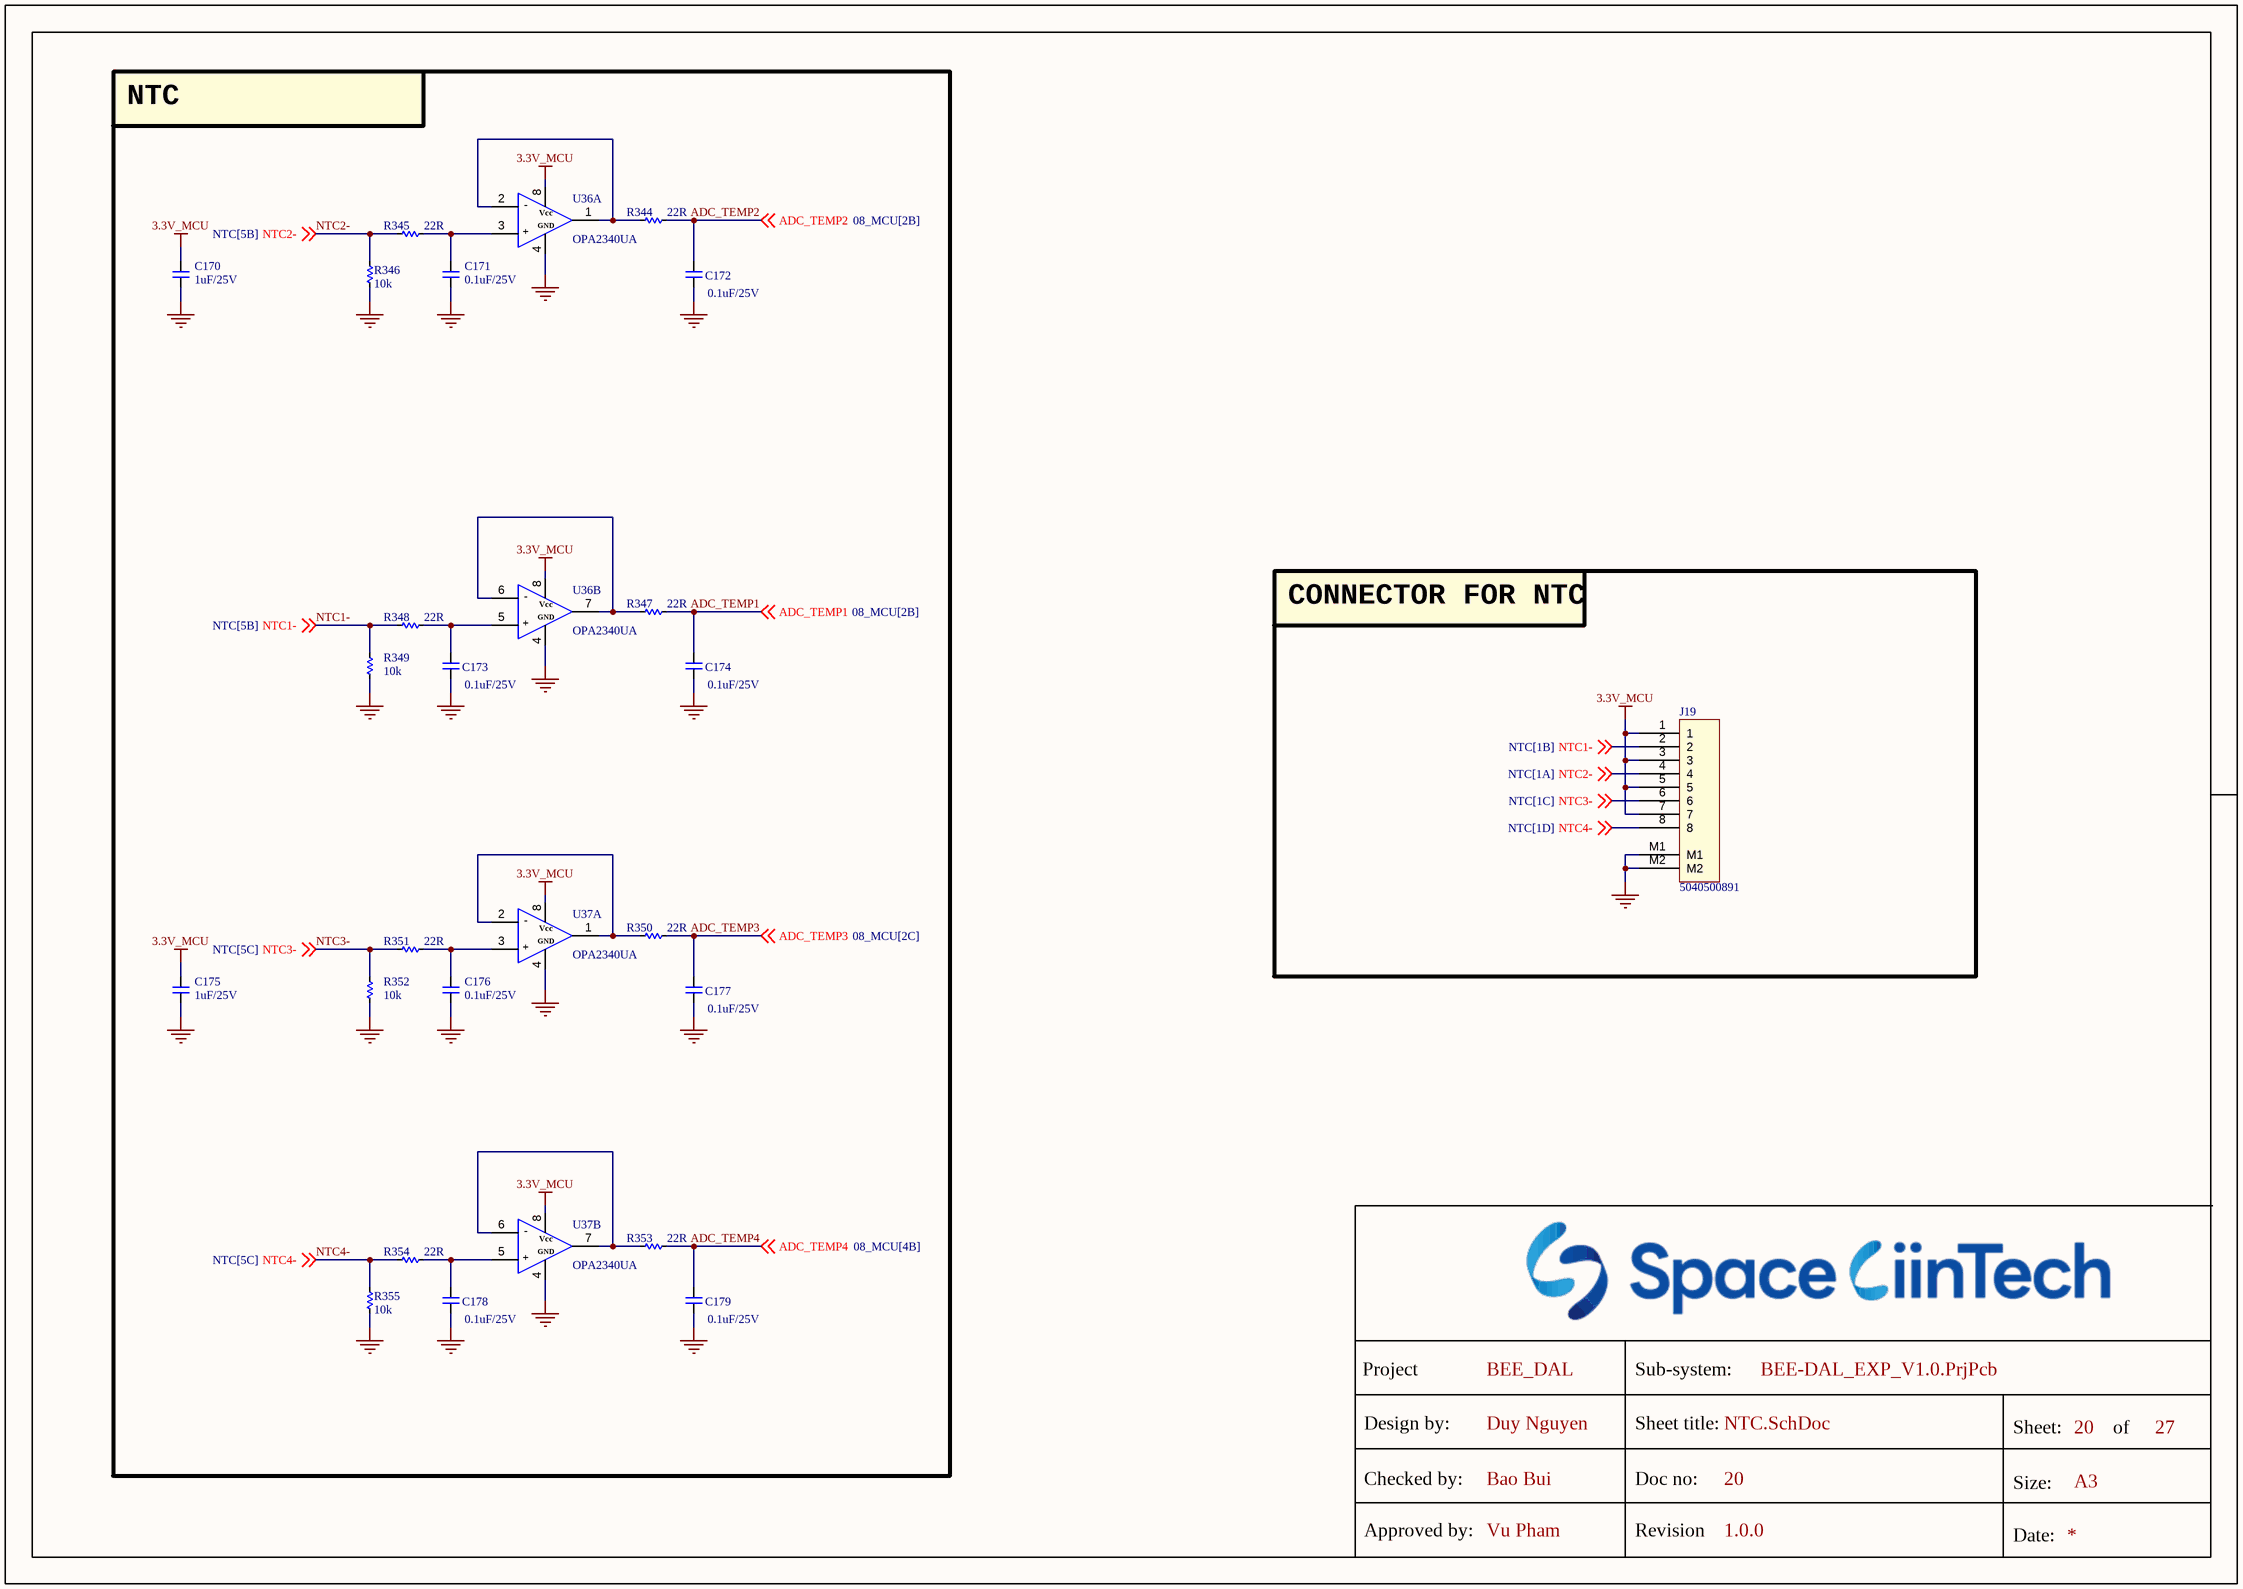
[diagram p23: NTC.SchDoc]

### Parts
C170  1uF/25V  [CAP_C_1005X60]
C171  0.1uF/25V  [CAP_C_1005X60]
C172  0.1uF/25V  [CAP_C_1005X60]
C173  0.1uF/25V  [CAP_C_1005X60]
C174  0.1uF/25V  [CAP_C_1005X60]
C175  1uF/25V  [CAP_C_1005X60]
C176  0.1uF/25V  [CAP_C_1005X60]
C177  0.1uF/25V  [CAP_C_1005X60]
C178  0.1uF/25V  [CAP_C_1005X60]
C179  0.1uF/25V  [CAP_C_1005X60]
J19  5040500891  [MOLEX_5040500891]
R344  22R  [RES_C_1005X40]
R345  22R  [RES_C_1005X40]
R346  10k  [RES_C_1005X40]
R347  22R  [RES_C_1005X40]
R348  22R  [RES_C_1005X40]
R349  10k  [RES_C_1005X40]
R350  22R  [RES_C_1005X40]
R351  22R  [RES_C_1005X40]
R352  10k  [RES_C_1005X40]
R353  22R  [RES_C_1005X40]
R354  22R  [RES_C_1005X40]
R355  10k  [RES_C_1005X40]
U36  OPA2340UA  [SOIC127P602X173-8N]  (parts A,B of 2)
U37  OPA2340UA  [SOIC127P602X173-8N]  (parts A,B of 2)

### Blocks framed on the sheet
NTC: C170-C179 R344-R355 U36 U37
CONNECTOR FOR NTC: J19

### Nets
3.3V_MCU: C170.2 C175.2 J19.1 J19.3 J19.5 J19.7 U36.8 U37.8
GND: C170.1 C171.1 C172.1 C173.1 C174.1 C175.1 C176.1 C177.1 C178.1 C179.1 J19.M1 J19.M2 R346.1 R349.1 R352.1 R355.1 U36.4 U37.4
ADC_TEMP1: C174.2 R347.2 ; off-sheet ADC_TEMP1
ADC_TEMP2: C172.2 R344.2 ; off-sheet ADC_TEMP2
ADC_TEMP3: C177.2 R350.2 ; off-sheet ADC_TEMP3
ADC_TEMP4: C179.2 R353.2 ; off-sheet ADC_TEMP4
NTC1-: J19.2 R348.1 R349.2 ; off-sheet NTC1-
NTC2-: J19.4 R345.1 R346.2 ; off-sheet NTC2-
NTC3-: J19.6 R351.1 R352.2 ; off-sheet NTC3-
NTC4-: J19.8 R354.1 R355.2 ; off-sheet NTC4-
NetC171_2: C171.2 R345.2 U36.3
NetC173_2: C173.2 R348.2 U36.5
NetC176_2: C176.2 R351.2 U37.3
NetC178_2: C178.2 R354.2 U37.5
NetR344_1: R344.1 U36.1 U36.2
NetR347_1: R347.1 U36.6 U36.7
NetR350_1: R350.1 U37.1 U37.2
NetR353_1: R353.1 U37.6 U37.7

### Notes on the sheet
- Project
- Sub-system:
- Design by:
- Sheet title:
- Sheet:
- of
- Checked by:
- Approved by:
- Doc no:
- Revision
- Size:
- Date:
- (in symbol OPA2340UA, part A) -; Vcc; GND; +
- (in symbol OPA2340UA, part B) -; Vcc; GND; +

### Library data of the parts
C170-C179 = _CAP_C_2: CAP
J19 = Header 8x1_2M
R344-R355 = _RES_B_2: RES

## Sheet LIMIT_SENSORS.SchDoc
size 420 x 297 mm; SheetNumber: 27; SheetTotal: 27
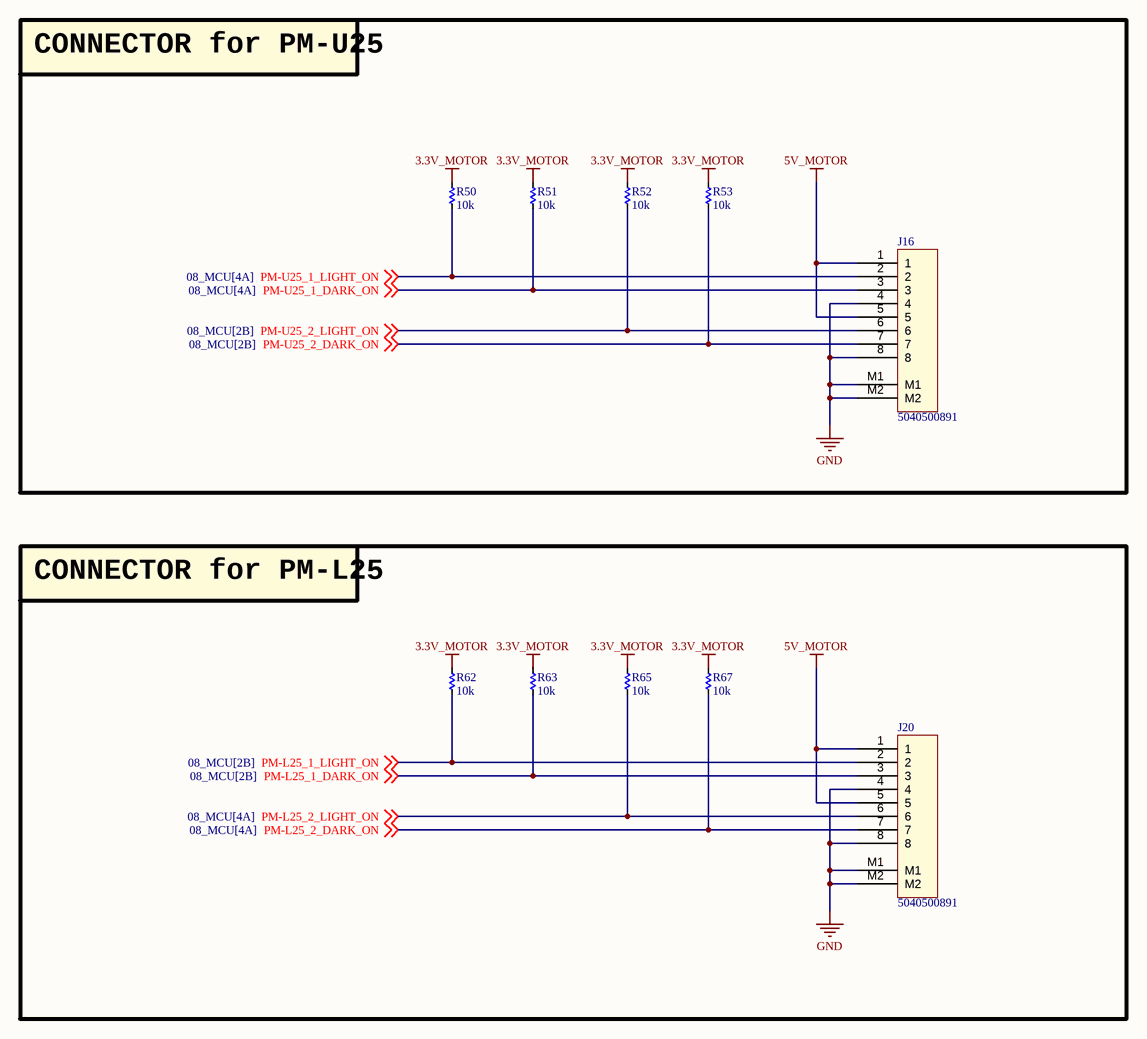
[diagram p24: LIMIT_SENSORS.SchDoc]

### Parts
(Parts that share a designator on the sheet are numbered #1, #2 ... from top to bottom, then left to right.)
J16#1  5040500891  [MOLEX_5040500891]
J20  5040500891  [MOLEX_5040500891]
R50  10k  [RES_C_1005X40]
R51  10k  [RES_C_1005X40]
R52  10k  [RES_C_1005X40]
R53  10k  [RES_C_1005X40]
R62  10k  [RES_C_1005X40]
R63  10k  [RES_C_1005X40]
R65  10k  [RES_C_1005X40]
R67  10k  [RES_C_1005X40]

### Blocks framed on the sheet
CONNECTOR for PM-U25: J16#1 R50-R53
CONNECTOR for PM-L25: J20 R62 R63 R65 R67

### Nets
3.3V_MOTOR: R50.2 R51.2 R52.2 R53.2 R62.2 R63.2 R65.2 R67.2
5V_MOTOR: J16#1.1 J16#1.5 J20.1 J20.5
GND: J16#1.4 J16#1.8 J16#1.M1 J16#1.M2 J20.4 J20.8 J20.M1 J20.M2
PM-L25_1_DARK_ON: J20.3 R63.1 ; off-sheet PM-L25_1_DARK_ON
PM-L25_1_LIGHT_ON: J20.2 R62.1 ; off-sheet PM-L25_1_LIGHT_ON
PM-L25_2_DARK_ON: J20.7 R67.1 ; off-sheet PM-L25_2_DARK_ON
PM-L25_2_LIGHT_ON: J20.6 R65.1 ; off-sheet PM-L25_2_LIGHT_ON
PM-U25_1_DARK_ON: J16#1.3 R51.1 ; off-sheet PM-U25_1_DARK_ON
PM-U25_1_LIGHT_ON: J16#1.2 R50.1 ; off-sheet PM-U25_1_LIGHT_ON
PM-U25_2_DARK_ON: J16#1.7 R53.1 ; off-sheet PM-U25_2_DARK_ON
PM-U25_2_LIGHT_ON: J16#1.6 R52.1 ; off-sheet PM-U25_2_LIGHT_ON

### Notes on the sheet
- Project
- Sub-system:
- Design by:
- Sheet title:
- Sheet:
- of
- Checked by:
- Approved by:
- Doc no:
- Revision
- Size:
- Date:

### Library data of the parts
J16#1 J20 = Header 8x1_2M
R50-R53 R62 R63 R65 R67 = _RES_B_2: RES

## Sheet HALF_BRIDGE_DRIVER.SchDoc
size 420 x 297 mm; SheetNumber: 22; SheetTotal: 27
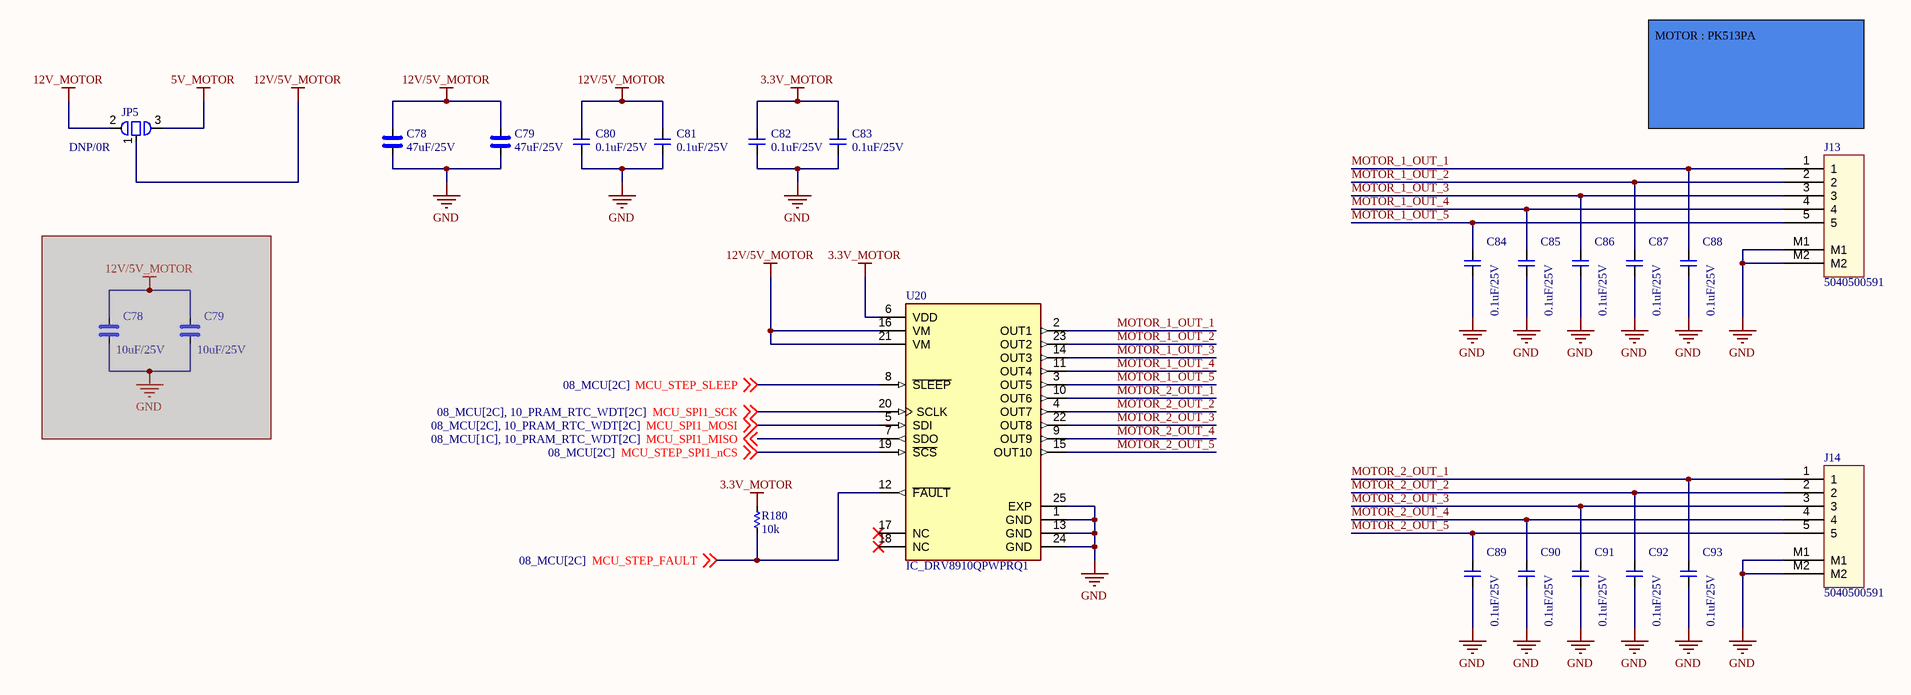
[diagram p25: HALF_BRIDGE_DRIVER.SchDoc]

### Parts
(Parts that share a designator on the sheet are numbered #1, #2 ... from top to bottom, then left to right.)
C78#1  47uF/25V  [CAP_C_3225X80]
C78#2  10uF/25V  [CAP_C_2012X110]  (masked out: inside a compile mask, not in the netlist)
C79#1  47uF/25V  [CAP_C_3225X80]
C79#2  10uF/25V  [CAP_C_2012X110]  (masked out: inside a compile mask, not in the netlist)
C80#1  0.1uF/25V  [CAP_C_1608X80]
C81#1  0.1uF/25V  [CAP_C_1608X80]
C82#1  0.1uF/25V  [CAP_C_1608X80]
C83#1  0.1uF/25V  [CAP_C_1608X80]
C84#1  0.1uF/25V  [CAP_C_1608X80]
C85#1  0.1uF/25V  [CAP_C_1608X80]
C86#1  0.1uF/25V  [CAP_C_1608X80]
C87#1  0.1uF/25V  [CAP_C_1608X80]
C88#1  0.1uF/25V  [CAP_C_1608X80]
C89#1  0.1uF/25V  [CAP_C_1608X80]
C90#1  0.1uF/25V  [CAP_C_1608X80]
C91#1  0.1uF/25V  [CAP_C_1608X80]
C92#1  0.1uF/25V  [CAP_C_1608X80]
C93#1  0.1uF/25V  [CAP_C_1608X80]
J13#1  5040500591  [MOLEX_5040500591]
J14#1  5040500591  [MOLEX_5040500591]
JP5  DNP/0R  [JUMPER_1-2_1608X60]
R180#1  10k  [RES_C_1005X40]
U20#1  IC_DRV8910QPWPRQ1  [IC_DRV8910QPWPRQ1]

### Nets
3.3V_MOTOR: C82#1.2 C83#1.2 R180#1.2 U20#1.6(VDD)
5V_MOTOR: JP5.3
12V/5V_MOTOR: C78#1.2 C79#1.2 C80#1.2 C81#1.2 JP5.1 U20#1.16(VM) U20#1.21(VM)
12V_MOTOR: JP5.2
GND: C78#1.1 C79#1.1 C80#1.1 C81#1.1 C82#1.1 C83#1.1 C84#1.1 C85#1.1 C86#1.1 C87#1.1 C88#1.1 C89#1.1 C90#1.1 C91#1.1 C92#1.1 C93#1.1 J13#1.M1 J13#1.M2 J14#1.M1 J14#1.M2 U20#1.1(GND) U20#1.13(GND) U20#1.24(GND) U20#1.25(EXP)
MCU_SPI1_MISO: U20#1.7(SDO) ; off-sheet MCU_SPI1_MISO
MCU_SPI1_MOSI: U20#1.5(SDI) ; off-sheet MCU_SPI1_MOSI
MCU_SPI1_SCK: U20#1.20(SCLK) ; off-sheet MCU_SPI1_SCK
MCU_STEP_FAULT: R180#1.1 U20#1.12(~{FAULT}) ; off-sheet MCU_STEP_FAULT
MCU_STEP_SLEEP: U20#1.8(~{SLEEP}) ; off-sheet MCU_STEP_SLEEP
MCU_STEP_SPI1_nCS: U20#1.19(~{SCS}) ; off-sheet MCU_STEP_SPI1_nCS
MOTOR_1_OUT_1: C88#1.2 J13#1.1 U20#1.2(OUT1)
MOTOR_1_OUT_2: C87#1.2 J13#1.2 U20#1.23(OUT2)
MOTOR_1_OUT_3: C86#1.2 J13#1.3 U20#1.14(OUT3)
MOTOR_1_OUT_4: C85#1.2 J13#1.4 U20#1.11(OUT4)
MOTOR_1_OUT_5: C84#1.2 J13#1.5 U20#1.3(OUT5)
MOTOR_2_OUT_1: C93#1.2 J14#1.1 U20#1.10(OUT6)
MOTOR_2_OUT_2: C92#1.2 J14#1.2 U20#1.4(OUT7)
MOTOR_2_OUT_3: C91#1.2 J14#1.3 U20#1.22(OUT8)
MOTOR_2_OUT_4: C90#1.2 J14#1.4 U20#1.9(OUT9)
MOTOR_2_OUT_5: C89#1.2 J14#1.5 U20#1.15(OUT10)

Not connected (* = marked no-connect by the designer): U20#1 17(NC)* 18(NC)*

### Notes on the sheet
- (near J13#1) MOTOR : PK513PA
- Project
- Sub-system:
- Design by:
- Sheet title:
- Sheet:
- of
- Checked by:
- Approved by:
- Doc no:
- Revision
- Size:
- Date:

### Library data of the parts
C78#1 C78#2 C79#1 C79#2 = _CAP_C_High_2: CAP High Value
C80#1 C81#1 C82#1 C83#1 C84#1 C85#1 C86#1 C87#1 C88#1 C89#1 C90#1 C91#1 C92#1 C93#1 = _CAP_C_2: CAP
J13#1 J14#1 = Header 5x1_2M
JP5 = JUMPER_1_2
R180#1 = _RES_B_2: RES
U20#1 = IC_DRV8910QPWPRQ1: Automotive, 40-V, 6-A, 10-channel half-bridge motor driver with advanced diagnostics; MF: Texas Instruments; Package: HTSSOP-24 Texas Instruments; Price: None; Check_prices: https://www.snapeda.com/parts/DRV8910QPWPRQ1/Texas+Instruments/view-part/?ref=eda; Value: *; SnapEDA_Link: https://www.snapeda.com/parts/DRV8910QPWPRQ1/Texas+Instruments/view-part/?ref=snap; MP: DRV8910QPWPRQ1; Availability: In Stock; Purchase-URL: https://pricing.snapeda.com/search?q=DRV8910QPWPRQ1&ref=eda

## Sheet 19_STEP_MOTOR_DRIVER_1.SchDoc
size 420 x 297 mm; SheetNumber: 23; SheetTotal: 27
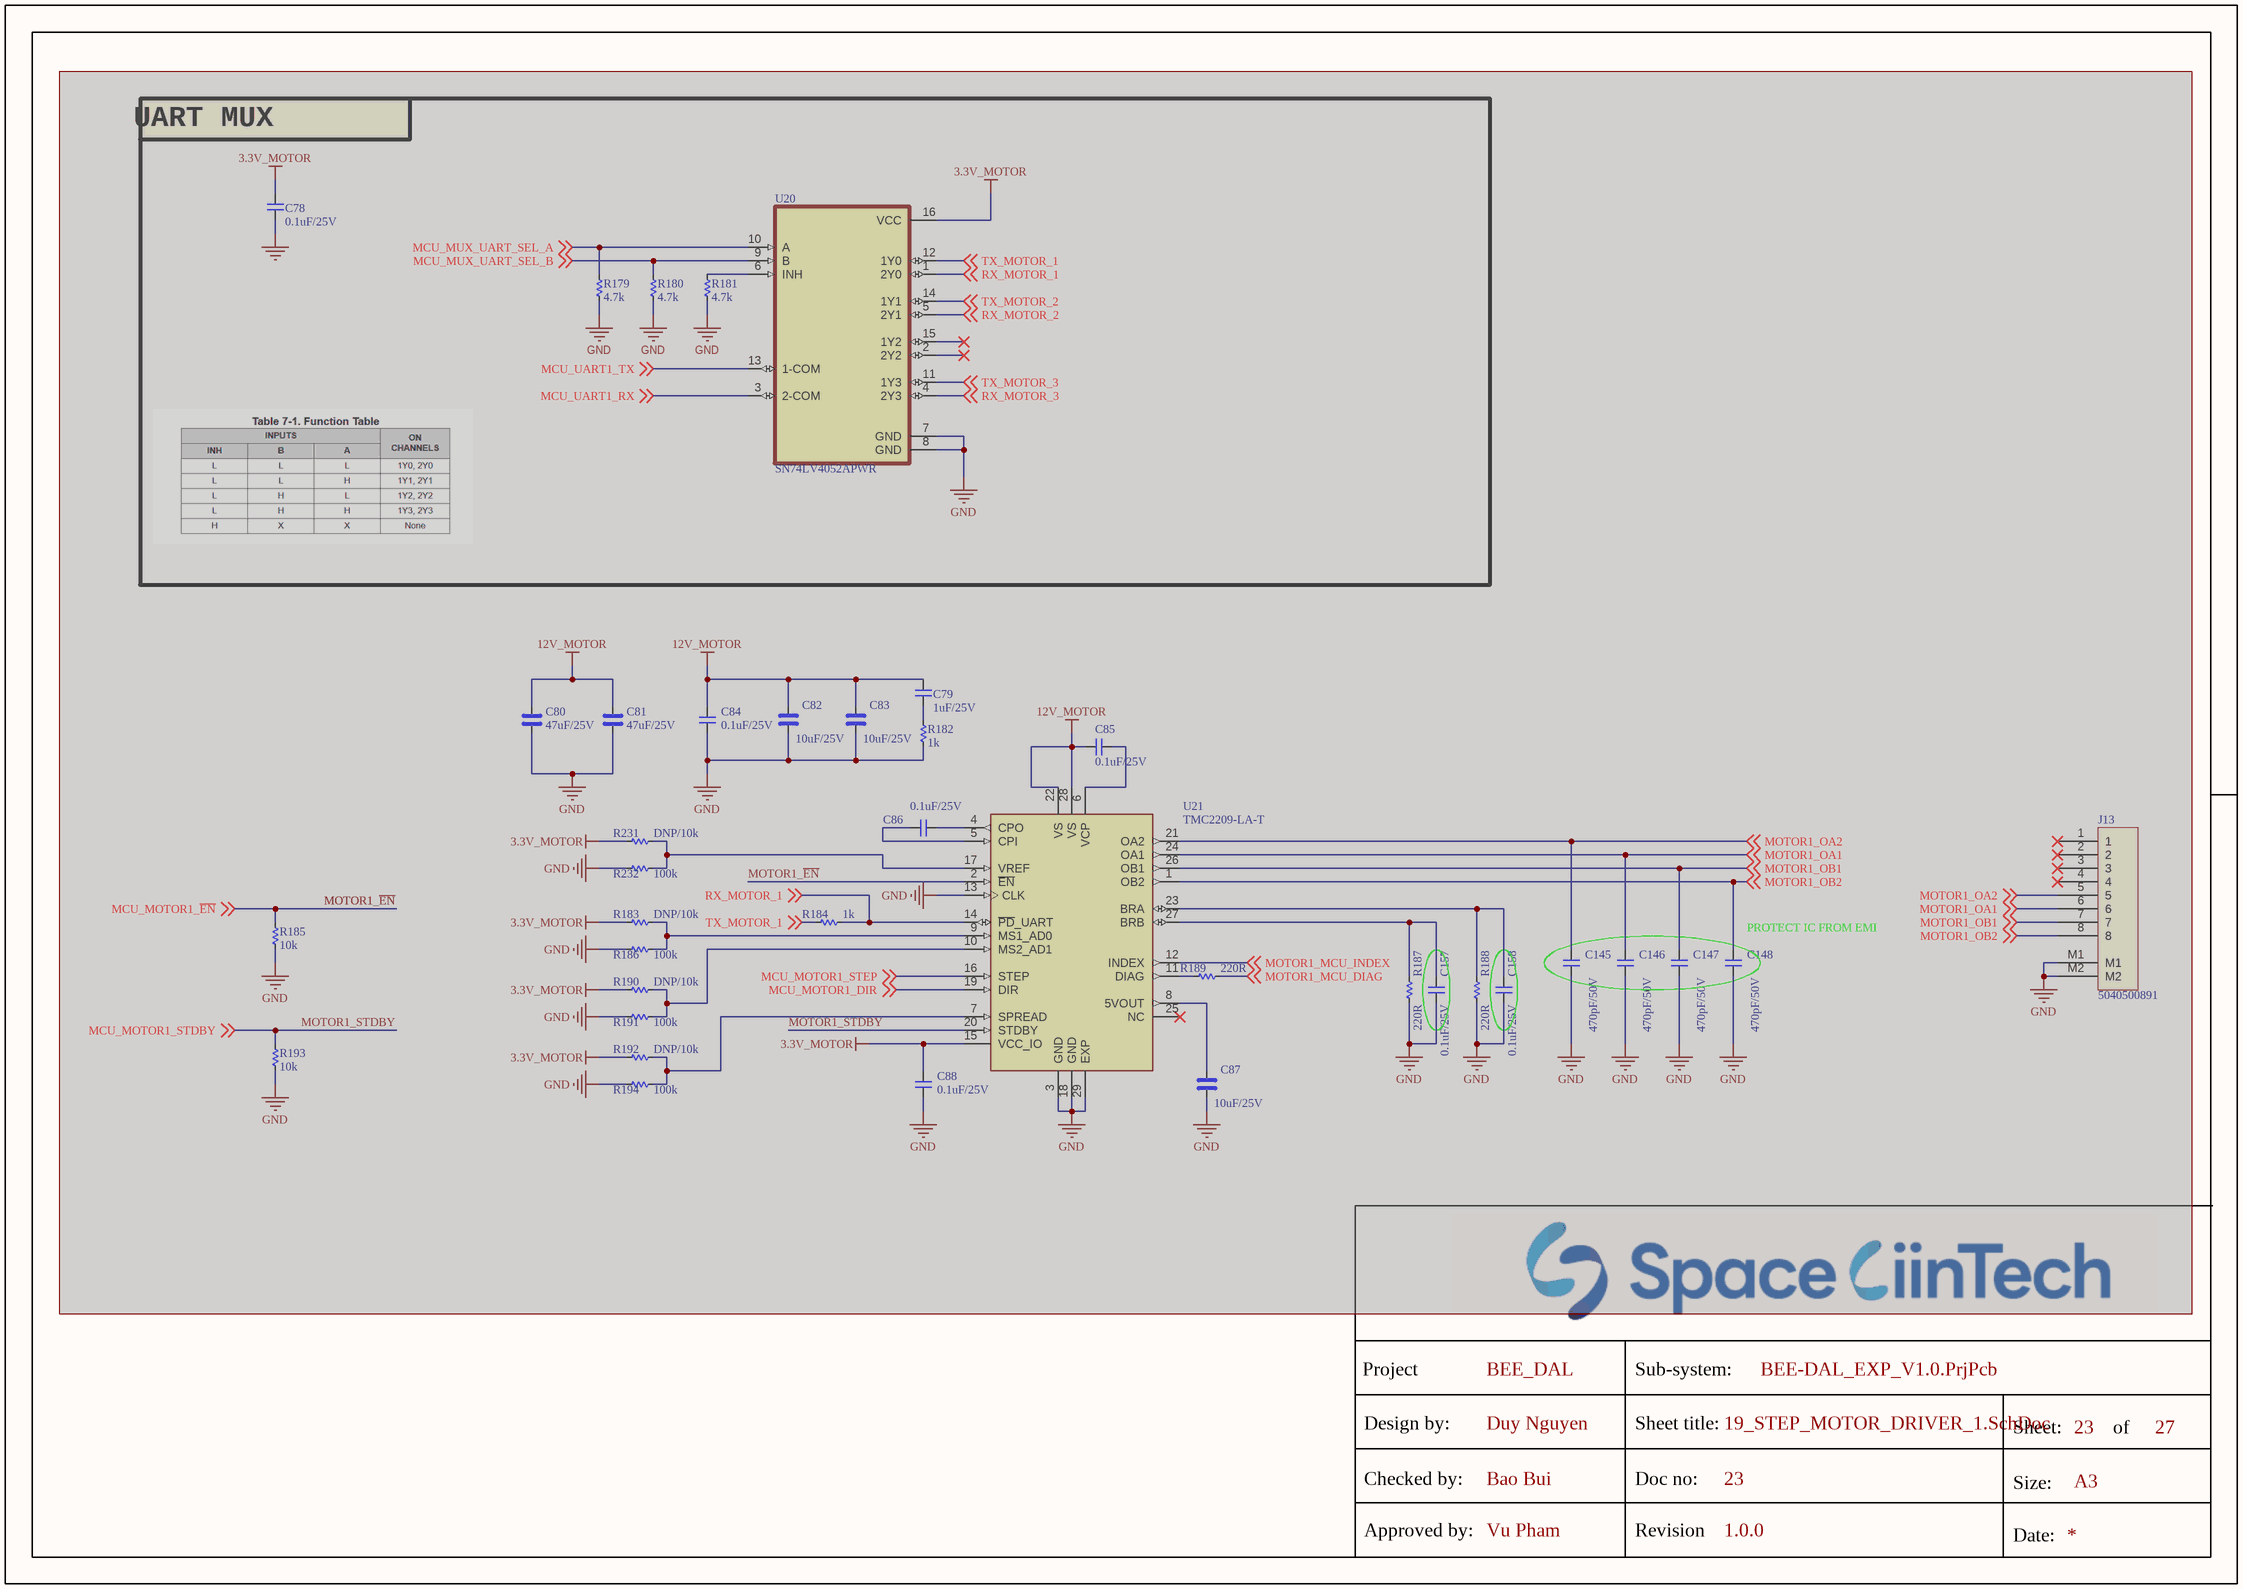
[diagram p26: 19_STEP_MOTOR_DRIVER_1.SchDoc]

### Parts
(Parts that share a designator on the sheet are numbered #1, #2 ... from top to bottom, then left to right.)
C78#3  0.1uF/25V  [CAP_C_1005X60]  (masked out: inside a compile mask, not in the netlist)
C79#3  1uF/25V  [CAP_C_1005X60]  (masked out: inside a compile mask, not in the netlist)
C80#2  47uF/25V  [CAP_C_3225X80]  (masked out: inside a compile mask, not in the netlist)
C81#2  47uF/25V  [CAP_C_3225X80]  (masked out: inside a compile mask, not in the netlist)
C82#2  10uF/25V  [CAP_C_2012X110]  (masked out: inside a compile mask, not in the netlist)
C83#2  10uF/25V  [CAP_C_2012X110]  (masked out: inside a compile mask, not in the netlist)
C84#2  0.1uF/25V  [CAP_C_1005X60]  (masked out: inside a compile mask, not in the netlist)
C85#2  0.1uF/25V  [CAP_C_1005X60]  (masked out: inside a compile mask, not in the netlist)
C86#2  0.1uF/25V  [CAP_C_1005X60]  (masked out: inside a compile mask, not in the netlist)
C87#2  10uF/25V  [CAP_C_2012X110]  (masked out: inside a compile mask, not in the netlist)
C88#2  0.1uF/25V  [CAP_C_1005X60]  (masked out: inside a compile mask, not in the netlist)
C145  470pF/50V  [CAP_C_1608X80]  (masked out: inside a compile mask, not in the netlist)
C146  470pF/50V  [CAP_C_1608X80]  (masked out: inside a compile mask, not in the netlist)
C147  470pF/50V  [CAP_C_1608X80]  (masked out: inside a compile mask, not in the netlist)
C148  470pF/50V  [CAP_C_1608X80]  (masked out: inside a compile mask, not in the netlist)
C157  0.1uF/25V  [CAP_C_1608X80]  (masked out: inside a compile mask, not in the netlist)
C158  0.1uF/25V  [CAP_C_1608X80]  (masked out: inside a compile mask, not in the netlist)
J13#2  5040500891  [MOLEX_5040500891]  (masked out: inside a compile mask, not in the netlist)
R179#2  4.7k  [RES_C_1005X40]  (masked out: inside a compile mask, not in the netlist)
R180#2  4.7k  [RES_C_1005X40]  (masked out: inside a compile mask, not in the netlist)
R181  4.7k  [RES_C_1005X40]  (masked out: inside a compile mask, not in the netlist)
R182  1k  [RES_C_1005X40]  (masked out: inside a compile mask, not in the netlist)
R183  DNP/10k  [RES_C_1005X40]  (masked out: inside a compile mask, not in the netlist)
R184  1k  [RES_C_1005X40]  (masked out: inside a compile mask, not in the netlist)
R185  10k  [RES_C_1005X40]  (masked out: inside a compile mask, not in the netlist)
R186  100k  [RES_C_1005X40]  (masked out: inside a compile mask, not in the netlist)
R187  220R  [RES_C_1005X40]  (masked out: inside a compile mask, not in the netlist)
R188  220R  [RES_C_1005X40]  (masked out: inside a compile mask, not in the netlist)
R189  220R  [RES_C_1005X40]  (masked out: inside a compile mask, not in the netlist)
R190  DNP/10k  [RES_C_1005X40]  (masked out: inside a compile mask, not in the netlist)
R191  100k  [RES_C_1005X40]  (masked out: inside a compile mask, not in the netlist)
R192  DNP/10k  [RES_C_1005X40]  (masked out: inside a compile mask, not in the netlist)
R193  10k  [RES_C_1005X40]  (masked out: inside a compile mask, not in the netlist)
R194  100k  [RES_C_1005X40]  (masked out: inside a compile mask, not in the netlist)
R231#1  DNP/10k  [RES_C_1005X40]  (masked out: inside a compile mask, not in the netlist)
R232#1  100k  [RES_C_1005X40]  (masked out: inside a compile mask, not in the netlist)
U20#2  SN74LV4052APWR  [SOP65P640X120-16N]  (masked out: inside a compile mask, not in the netlist)
U21  TMC2209-LA-T  [QFN50P500X500X90-29N]  (masked out: inside a compile mask, not in the netlist)

### Blocks framed on the sheet
UART MUX: C78#3 R179#2 R180#2 R181 U20#2

### Notes on the sheet
- (near C148) PROTECT IC FROM EMI
- Project
- Sub-system:
- Design by:
- Sheet title:
- Sheet:
- of
- Checked by:
- Approved by:
- Doc no:
- Revision
- Size:
- Date:

### Library data of the parts
C78#3 C79#3 C84#2 C85#2 C86#2 C88#2 C145-C148 C157 C158 = _CAP_C_2: CAP
C80#2 C81#2 C82#2 C83#2 C87#2 = _CAP_C_High_2: CAP High Value
J13#2 = Header 8x1_2M
R179#2 R180#2 R181-R194 R231#1 R232#1 = _RES_B_2: RES
U20#2 = SN74LV4052APWR: 5-V, 4:1, 2-channel analog multiplexer; MF: Texas Instruments; SnapEDA_Link: https://www.snapeda.com/parts/SN74LV4052APWR/Texas+Instruments/view-part/?ref=snap; Package: TSSOP-16 Texas Instruments; Value: *; MP: SN74LV4052APWR; Check_prices: https://www.snapeda.com/parts/SN74LV4052APWR/Texas+Instruments/view-part/?ref=eda
U21 = TMC2209-LA-T: Bipolar Motor Driver Power MOSFET Step/Direction, UART 28-QFN (5x5); MF: Trinamic Motion Control GmbH; SnapEDA_Link: https://www.snapeda.com/parts/TMC2209-LA-T/Trinamic/view-part/?ref=snap; Package: VFQFN-28 Trinamic; Value: *; MP: TMC2209-LA-T; Check_prices: https://www.snapeda.com/parts/TMC2209-LA-T/Trinamic/view-part/?ref=eda

## Sheet 20_STEP_MOTOR_DRIVER_2.SchDoc
size 420 x 297 mm; SheetNumber: 24; SheetTotal: 27
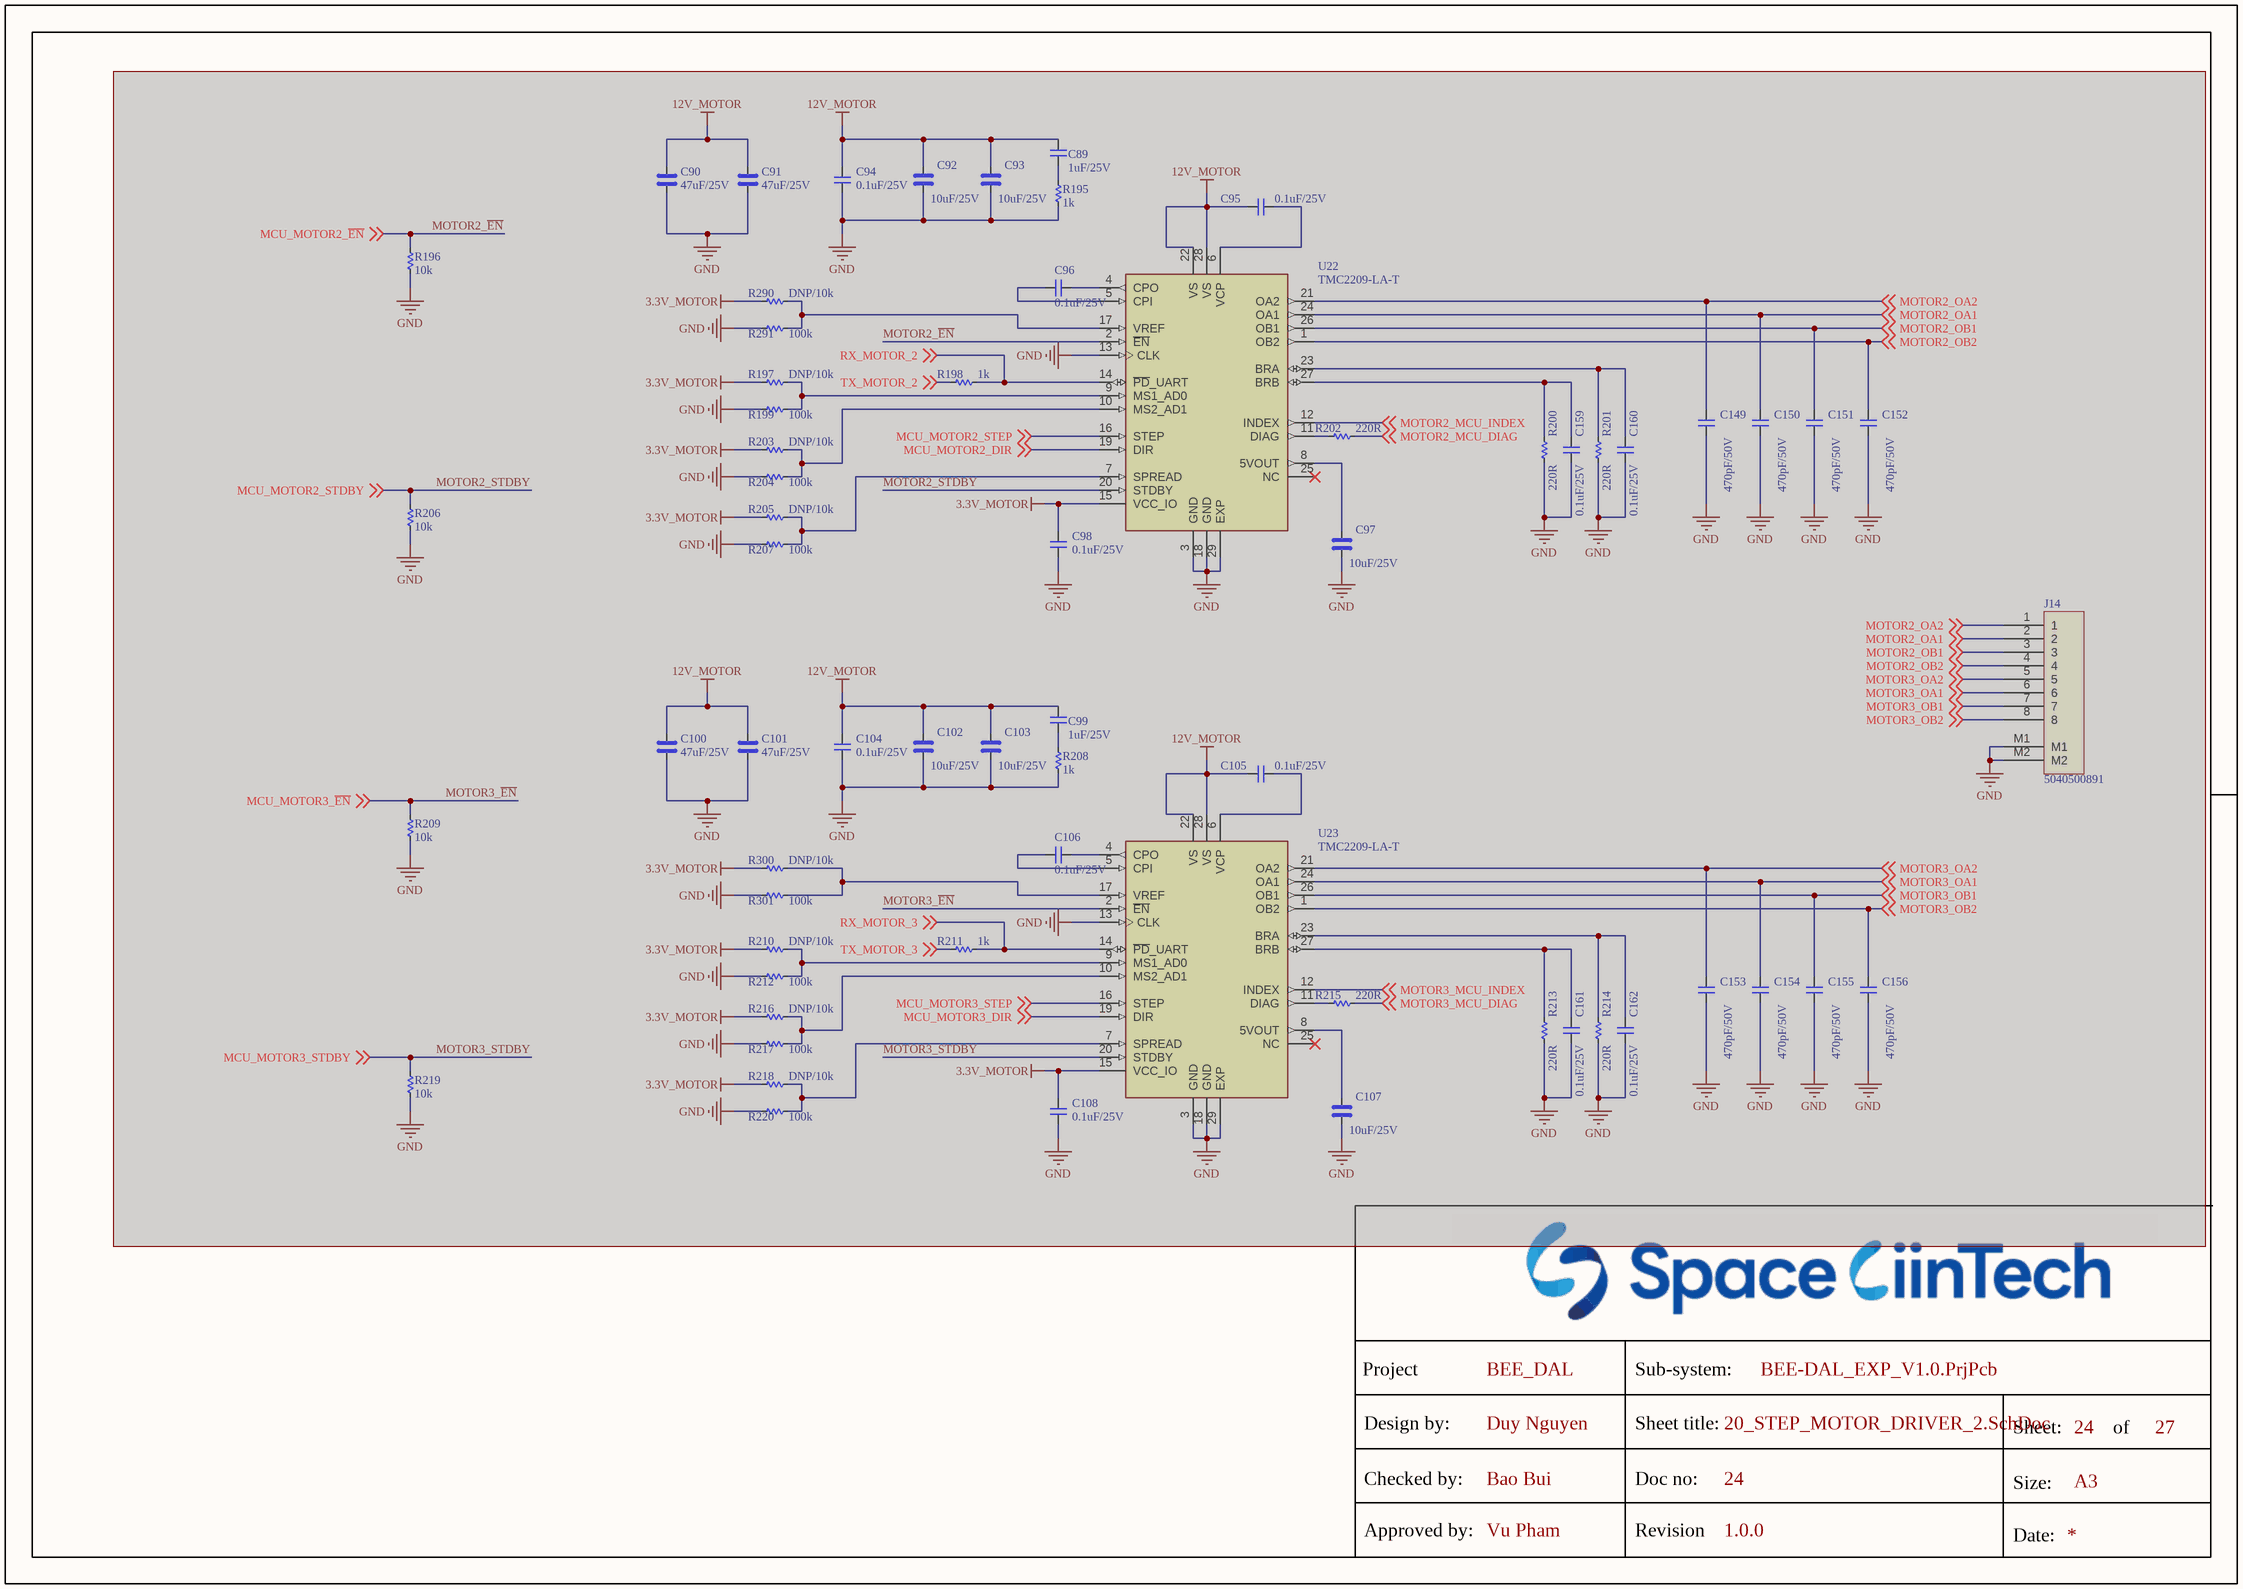
[diagram p27: 20_STEP_MOTOR_DRIVER_2.SchDoc]

### Parts
(Parts that share a designator on the sheet are numbered #1, #2 ... from top to bottom, then left to right.)
C89#2  1uF/25V  [CAP_C_1005X60]  (masked out: inside a compile mask, not in the netlist)
C90#2  47uF/25V  [CAP_C_3225X80]  (masked out: inside a compile mask, not in the netlist)
C91#2  47uF/25V  [CAP_C_3225X80]  (masked out: inside a compile mask, not in the netlist)
C92#2  10uF/25V  [CAP_C_2012X110]  (masked out: inside a compile mask, not in the netlist)
C93#2  10uF/25V  [CAP_C_2012X110]  (masked out: inside a compile mask, not in the netlist)
C94  0.1uF/25V  [CAP_C_1005X60]  (masked out: inside a compile mask, not in the netlist)
C95  0.1uF/25V  [CAP_C_1005X60]  (masked out: inside a compile mask, not in the netlist)
C96  0.1uF/25V  [CAP_C_1005X60]  (masked out: inside a compile mask, not in the netlist)
C97  10uF/25V  [CAP_C_2012X110]  (masked out: inside a compile mask, not in the netlist)
C98  0.1uF/25V  [CAP_C_1005X60]  (masked out: inside a compile mask, not in the netlist)
C99  1uF/25V  [CAP_C_1005X60]  (masked out: inside a compile mask, not in the netlist)
C100  47uF/25V  [CAP_C_3225X80]  (masked out: inside a compile mask, not in the netlist)
C101  47uF/25V  [CAP_C_3225X80]  (masked out: inside a compile mask, not in the netlist)
C102  10uF/25V  [CAP_C_2012X110]  (masked out: inside a compile mask, not in the netlist)
C103  10uF/25V  [CAP_C_2012X110]  (masked out: inside a compile mask, not in the netlist)
C104  0.1uF/25V  [CAP_C_1005X60]  (masked out: inside a compile mask, not in the netlist)
C105  0.1uF/25V  [CAP_C_1005X60]  (masked out: inside a compile mask, not in the netlist)
C106  0.1uF/25V  [CAP_C_1005X60]  (masked out: inside a compile mask, not in the netlist)
C107  10uF/25V  [CAP_C_2012X110]  (masked out: inside a compile mask, not in the netlist)
C108  0.1uF/25V  [CAP_C_1005X60]  (masked out: inside a compile mask, not in the netlist)
C149  470pF/50V  [CAP_C_1608X80]  (masked out: inside a compile mask, not in the netlist)
C150  470pF/50V  [CAP_C_1608X80]  (masked out: inside a compile mask, not in the netlist)
C151  470pF/50V  [CAP_C_1608X80]  (masked out: inside a compile mask, not in the netlist)
C152  470pF/50V  [CAP_C_1608X80]  (masked out: inside a compile mask, not in the netlist)
C153  470pF/50V  [CAP_C_1608X80]  (masked out: inside a compile mask, not in the netlist)
C154  470pF/50V  [CAP_C_1608X80]  (masked out: inside a compile mask, not in the netlist)
C155  470pF/50V  [CAP_C_1608X80]  (masked out: inside a compile mask, not in the netlist)
C156  470pF/50V  [CAP_C_1608X80]  (masked out: inside a compile mask, not in the netlist)
C159  0.1uF/25V  [CAP_C_1608X80]  (masked out: inside a compile mask, not in the netlist)
C160  0.1uF/25V  [CAP_C_1608X80]  (masked out: inside a compile mask, not in the netlist)
C161  0.1uF/25V  [CAP_C_1608X80]  (masked out: inside a compile mask, not in the netlist)
C162  0.1uF/25V  [CAP_C_1608X80]  (masked out: inside a compile mask, not in the netlist)
J14#2  5040500891  [MOLEX_5040500891]  (masked out: inside a compile mask, not in the netlist)
R195  1k  [RES_C_1005X40]  (masked out: inside a compile mask, not in the netlist)
R196  10k  [RES_C_1005X40]  (masked out: inside a compile mask, not in the netlist)
R197  DNP/10k  [RES_C_1005X40]  (masked out: inside a compile mask, not in the netlist)
R198  1k  [RES_C_1005X40]  (masked out: inside a compile mask, not in the netlist)
R199  100k  [RES_C_1005X40]  (masked out: inside a compile mask, not in the netlist)
R200  220R  [RES_C_1005X40]  (masked out: inside a compile mask, not in the netlist)
R201  220R  [RES_C_1005X40]  (masked out: inside a compile mask, not in the netlist)
R202  220R  [RES_C_1005X40]  (masked out: inside a compile mask, not in the netlist)
R203  DNP/10k  [RES_C_1005X40]  (masked out: inside a compile mask, not in the netlist)
R204  100k  [RES_C_1005X40]  (masked out: inside a compile mask, not in the netlist)
R205  DNP/10k  [RES_C_1005X40]  (masked out: inside a compile mask, not in the netlist)
R206  10k  [RES_C_1005X40]  (masked out: inside a compile mask, not in the netlist)
R207  100k  [RES_C_1005X40]  (masked out: inside a compile mask, not in the netlist)
R208  1k  [RES_C_1005X40]  (masked out: inside a compile mask, not in the netlist)
R209  10k  [RES_C_1005X40]  (masked out: inside a compile mask, not in the netlist)
R210  DNP/10k  [RES_C_1005X40]  (masked out: inside a compile mask, not in the netlist)
R211  1k  [RES_C_1005X40]  (masked out: inside a compile mask, not in the netlist)
R212  100k  [RES_C_1005X40]  (masked out: inside a compile mask, not in the netlist)
R213  220R  [RES_C_1005X40]  (masked out: inside a compile mask, not in the netlist)
R214  220R  [RES_C_1005X40]  (masked out: inside a compile mask, not in the netlist)
R215  220R  [RES_C_1005X40]  (masked out: inside a compile mask, not in the netlist)
R216  DNP/10k  [RES_C_1005X40]  (masked out: inside a compile mask, not in the netlist)
R217  100k  [RES_C_1005X40]  (masked out: inside a compile mask, not in the netlist)
R218  DNP/10k  [RES_C_1005X40]  (masked out: inside a compile mask, not in the netlist)
R219  10k  [RES_C_1005X40]  (masked out: inside a compile mask, not in the netlist)
R220  100k  [RES_C_1005X40]  (masked out: inside a compile mask, not in the netlist)
R290  DNP/10k  [RES_C_1005X40]  (masked out: inside a compile mask, not in the netlist)
R291  100k  [RES_C_1005X40]  (masked out: inside a compile mask, not in the netlist)
R300  DNP/10k  [RES_C_1005X40]  (masked out: inside a compile mask, not in the netlist)
R301  100k  [RES_C_1005X40]  (masked out: inside a compile mask, not in the netlist)
U22  TMC2209-LA-T  [QFN50P500X500X90-29N]  (masked out: inside a compile mask, not in the netlist)
U23  TMC2209-LA-T  [QFN50P500X500X90-29N]  (masked out: inside a compile mask, not in the netlist)

### Notes on the sheet
- Project
- Sub-system:
- Design by:
- Sheet title:
- Sheet:
- of
- Checked by:
- Approved by:
- Doc no:
- Revision
- Size:
- Date:

### Library data of the parts
C89#2 C94-C96 C98 C99 C104-C106 C108 C149-C156 C159-C162 = _CAP_C_2: CAP
C90#2 C91#2 C92#2 C93#2 C97 C100-C103 C107 = _CAP_C_High_2: CAP High Value
J14#2 = Header 8x1_2M
R195-R220 R290 R291 R300 R301 = _RES_B_2: RES
U22 U23 = TMC2209-LA-T: as U21 on sheet 19_STEP_MOTOR_DRIVER_1; SnapEDA_Link: https://www.snapeda.com/parts/TMC2209-LA-T/Trinamic/view-part/?ref=snap; Package: VFQFN-28 Trinamic; Value: *; MP: TMC2209-LA-T; Check_prices: https://www.snapeda.com/parts/TMC2209-LA-T/Trinamic/view-part/?ref=eda

## Sheet 21_STEP_MOTOR_ISOLATOR_INPUT.SchDoc
size 420 x 297 mm; SheetNumber: 21; SheetTotal: 27
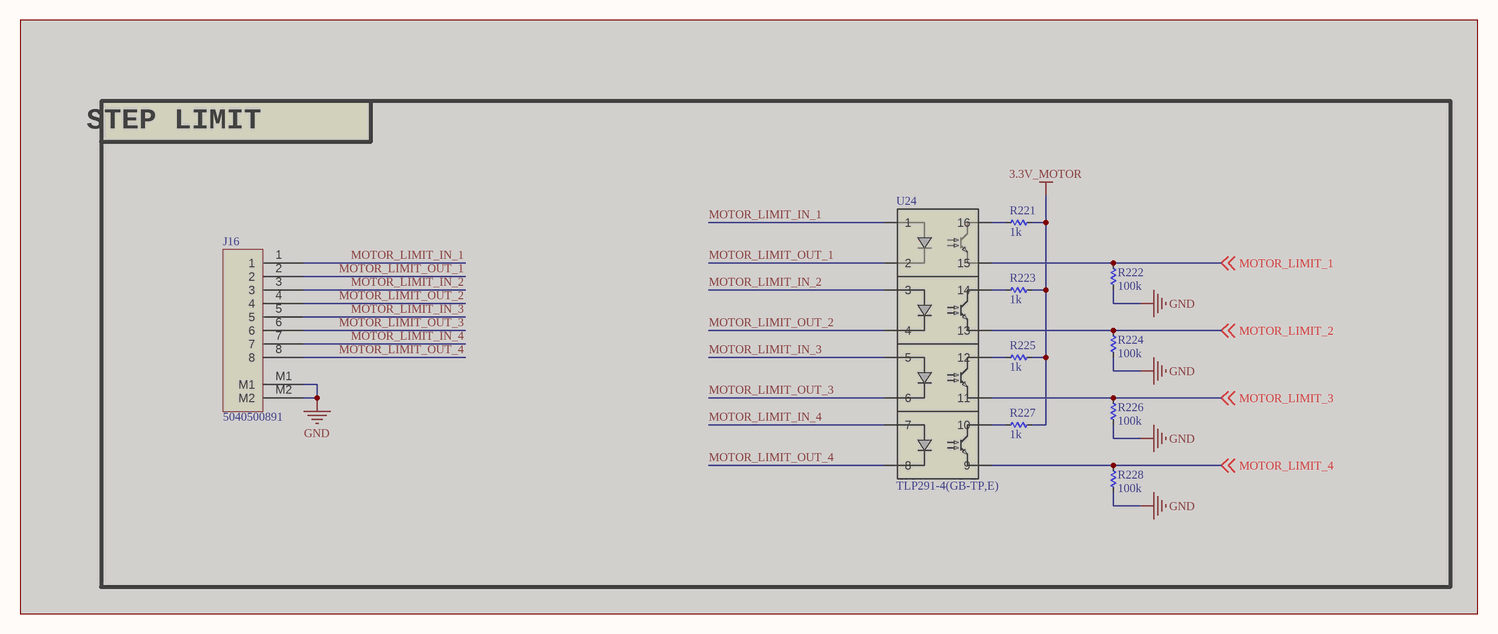
[diagram p28: 21_STEP_MOTOR_ISOLATOR_INPUT.SchDoc]

### Parts
(Parts that share a designator on the sheet are numbered #1, #2 ... from top to bottom, then left to right.)
J16#2  5040500891  [MOLEX_5040500891]  (masked out: inside a compile mask, not in the netlist)
R221  1k  [RES_C_1005X40]  (masked out: inside a compile mask, not in the netlist)
R222  100k  [RES_C_1005X40]  (masked out: inside a compile mask, not in the netlist)
R223  1k  [RES_C_1005X40]  (masked out: inside a compile mask, not in the netlist)
R224  100k  [RES_C_1005X40]  (masked out: inside a compile mask, not in the netlist)
R225  1k  [RES_C_1005X40]  (masked out: inside a compile mask, not in the netlist)
R226  100k  [RES_C_1005X40]  (masked out: inside a compile mask, not in the netlist)
R227  1k  [RES_C_1005X40]  (masked out: inside a compile mask, not in the netlist)
R228  100k  [RES_C_1005X40]  (masked out: inside a compile mask, not in the netlist)
U24  TLP291-4(GB-TP,E)  [SO16_TOS]  (masked out: inside a compile mask, not in the netlist)

### Blocks framed on the sheet
STEP LIMIT: J16#2 R221-R228 U24

### Notes on the sheet
- Project
- Sub-system:
- Design by:
- Sheet title:
- Sheet:
- of
- Checked by:
- Approved by:
- Doc no:
- Revision
- Size:
- Date:

### Library data of the parts
J16#2 = Header 8x1_2M
R221-R228 = _RES_B_2: RES
U24 = TLP291-4GB-TP,E: Description; Manufacturer_Name: Toshiba Electronic Devices & Storage Corp.; Source_Package: TLP291_4; Number_devices_in_Package: 1; Copyright: Copyright (C) 2026 Ultra Librarian. All rights reserved.; Manufacturer_Part_Number: TLP291-4(GB-TP,E); RefDes: Refdes; Type: Type

## Sheet 22_CONNECTOR_INTERFACE.SchDoc
size 420 x 297 mm; SheetNumber: 26; SheetTotal: 27
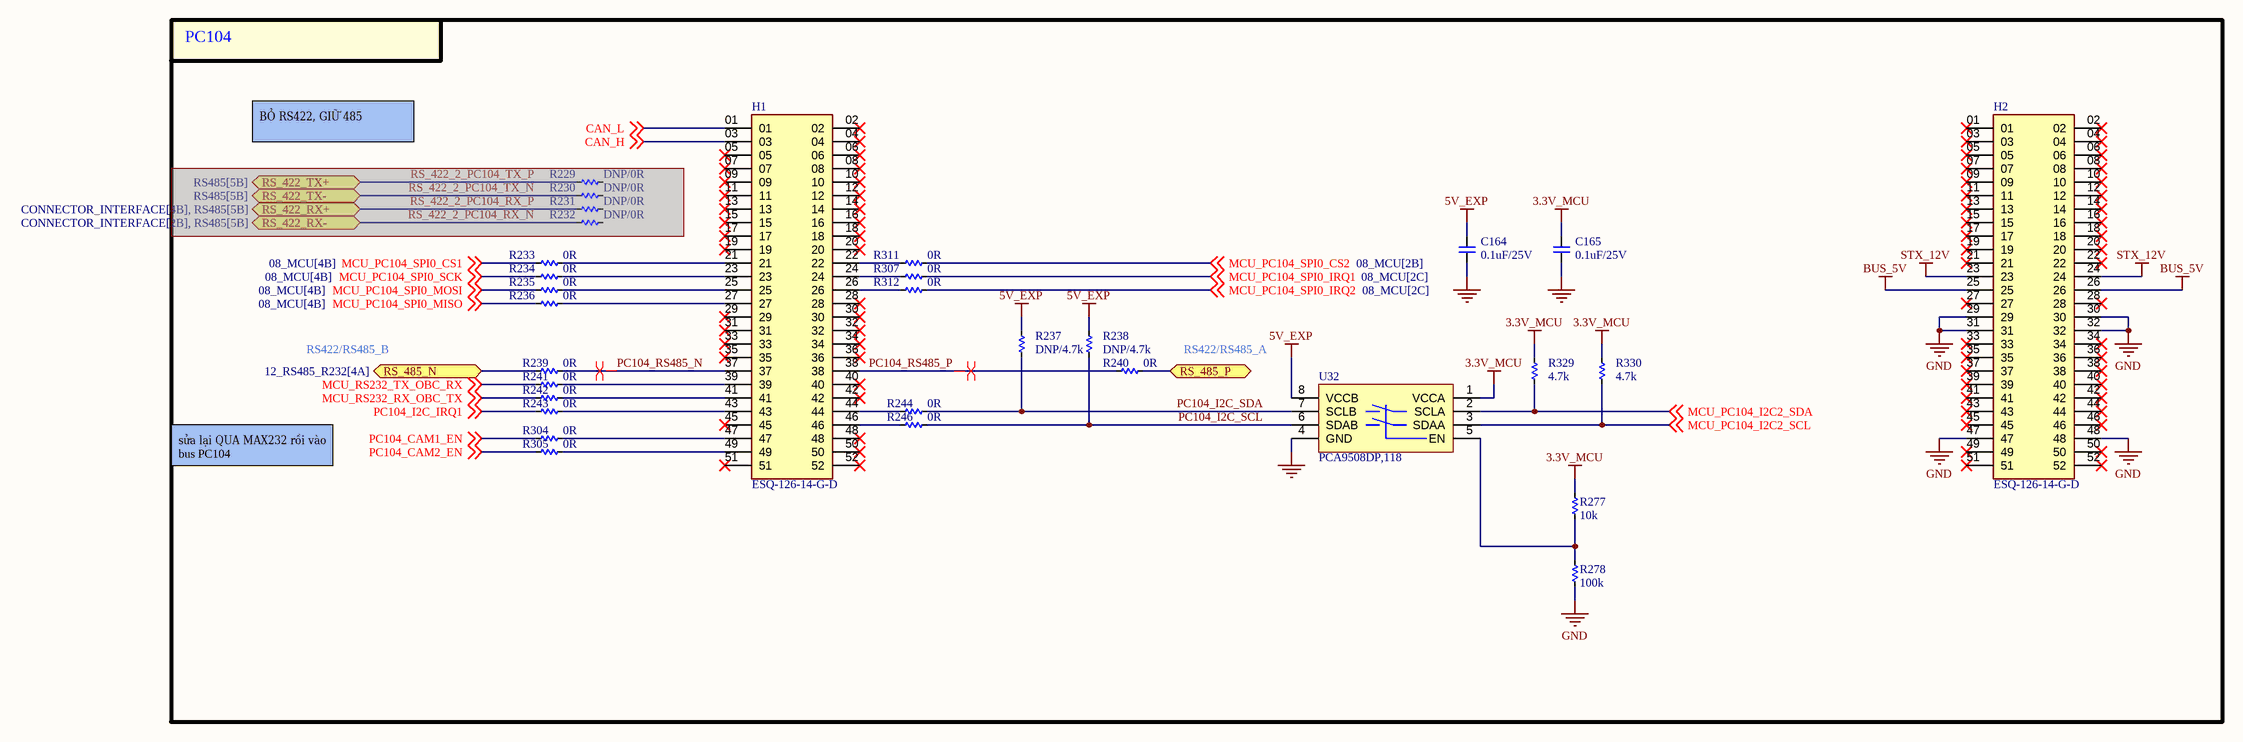
[diagram p29: 22_CONNECTOR_INTERFACE.SchDoc]

### Parts
(Parts that share a designator on the sheet are numbered #1, #2 ... from top to bottom, then left to right.)
C164  0.1uF/25V  [CAP_C_1005X60]
C165  0.1uF/25V  [CAP_C_1005X60]
H1  ESQ-126-14-G-D  [SAMTEC_ESQ-126-14-G-D]
H2  ESQ-126-14-G-D  [SAMTEC_ESQ-126-14-G-D]
R229  DNP/0R  [RES_C_1005X40]  (masked out: inside a compile mask, not in the netlist)
R230  DNP/0R  [RES_C_1005X40]  (masked out: inside a compile mask, not in the netlist)
R231#2  DNP/0R  [RES_C_1005X40]  (masked out: inside a compile mask, not in the netlist)
R232#2  DNP/0R  [RES_C_1005X40]  (masked out: inside a compile mask, not in the netlist)
R233  0R  [RES_C_1005X40]
R234  0R  [RES_C_1005X40]
R235  0R  [RES_C_1005X40]
R236  0R  [RES_C_1005X40]
R237  DNP/4.7k  [RES_C_1005X40]
R238  DNP/4.7k  [RES_C_1005X40]
R239  0R  [RES_C_1005X40]
R240  0R  [RES_C_1005X40]
R241  0R  [RES_C_1005X40]
R242  0R  [RES_C_1005X40]
R243  0R  [RES_C_1005X40]
R244  0R  [RES_C_1005X40]
R246  0R  [RES_C_1005X40]
R277#2  10k  [RES_C_1005X40]
R278#2  100k  [RES_C_1005X40]
R304  0R  [RES_C_1005X40]
R305  0R  [RES_C_1005X40]
R307  0R  [RES_C_1005X40]
R311  0R  [RES_C_1005X40]
R312  0R  [RES_C_1005X40]
R329  4.7k  [RES_C_1005X40]
R330  4.7k  [RES_C_1005X40]
U32  PCA9508DP,118  [TSOP8]

### Ports
RS_422_RX+ (bidir, see CONNECTOR_INTERFACE[4B], RS485[5B]), RS_422_RX- (bidir, see CONNECTOR_INTERFACE[2B], RS485[5B]), RS_422_TX+ (bidir, see RS485[5B]), RS_422_TX- (bidir, see RS485[5B]), RS_485_N (bidir, see 12_RS485_R232[4A]), RS_485_P (bidir, see 12_RS485_R232[4A])

### Nets
3.3V_MCU: C165.2 R277#2.1 R329.2 R330.2 U32.1(VCCA)
5V_EXP: C164.2 R237.2 R238.2 U32.8(VCCB)
BUS_5V: H2.25 H2.26
GND: C164.1 C165.1 H2.29 H2.30 H2.31 H2.32 H2.47 H2.48 R278#2.2 U32.4(GND)
STX_12V: H2.23 H2.24
CAN_H: H1.03 ; off-sheet CAN_H
CAN_L: H1.01 ; off-sheet CAN_L
MCU_PC104_I2C2_SCL: R330.1 U32.3(SDAA) ; off-sheet MCU_PC104_I2C2_SCL
MCU_PC104_I2C2_SDA: R329.1 U32.2(SCLA) ; off-sheet MCU_PC104_I2C2_SDA
MCU_PC104_SPI0_CS1: R233.1 ; off-sheet MCU_PC104_SPI0_CS1
MCU_PC104_SPI0_CS2: R311.1 ; off-sheet MCU_PC104_SPI0_CS2
MCU_PC104_SPI0_IRQ1: R307.2 ; off-sheet MCU_PC104_SPI0_IRQ1
MCU_PC104_SPI0_IRQ2: R312.2 ; off-sheet MCU_PC104_SPI0_IRQ2
MCU_PC104_SPI0_MISO: R236.1 ; off-sheet MCU_PC104_SPI0_MISO
MCU_PC104_SPI0_MOSI: R235.1 ; off-sheet MCU_PC104_SPI0_MOSI
MCU_PC104_SPI0_SCK: R234.1 ; off-sheet MCU_PC104_SPI0_SCK
MCU_RS232_RX_OBC_TX: R242.1 ; off-sheet MCU_RS232_RX_OBC_TX
MCU_RS232_TX_OBC_RX: R241.1 ; off-sheet MCU_RS232_TX_OBC_RX
PC104_CAM1_EN: R304.1 ; off-sheet PC104_CAM1_EN
PC104_CAM2_EN: R305.1 ; off-sheet PC104_CAM2_EN
PC104_I2C_IRQ1: R243.1 ; off-sheet PC104_I2C_IRQ1
PC104_I2C_SCL: R238.1 R246.2 U32.6(SDAB)
PC104_I2C_SDA: R237.1 R244.2 U32.7(SCLB)
PC104_RS485_N: H1.37 R239.2
PC104_RS485_P: H1.38 R240.1
RS_485_N: R239.1 ; port RS_485_N
RS_485_P: R240.2 ; port RS_485_P
NetH1_21: H1.21 R233.2
NetH1_22: H1.22 R311.2
NetH1_23: H1.23 R234.2
NetH1_24: H1.24 R307.1
NetH1_25: H1.25 R235.2
NetH1_26: H1.26 R312.1
NetH1_27: H1.27 R236.2
NetH1_39: H1.39 R241.2
NetH1_41: H1.41 R242.2
NetH1_43: H1.43 R243.2
NetH1_44: H1.44 R244.1
NetH1_46: H1.46 R246.1
NetH1_47: H1.47 R304.2
NetH1_49: H1.49 R305.2
NetR277#2_2: R277#2.2 R278#2.1 U32.5(EN)

Not connected (* = marked no-connect by the designer): H1 02* 04* 05* 06* 07* 08* 09* 10* 11* 12* 13* 14* 15* 16* 17* 18* 19* 20* 28* 29* 30* 31* 32* 33* 34* 35* 36* 40* 42* 45* 48* 50* 51* 52*; H2 01* 02* 03* 04* 05* 06* 07* 08* 09* 10* 11* 12* 13* 14* 15* 16* 17* 18* 19* 20* 21* 22* 27* 28* 33* 34* 35* 36* 37* 38* 39* 40* 41* 42* 43* 44* 45* 46* 49* 50* 51* 52*

### Layout directives
differential pair; differential pair class DIFF90; net class DIFF90; rule Matched Net Lengths [Tolerance = 4mil]: PC104_RS485_N, PC104_RS485_P

### Notes on the sheet
- PC104
- BỎ RS422, GIỮ 485
- RS422/RS485_B
- RS422/RS485_A
- sửa lại QUA MAX232 rồi vào bus PC104
- Project
- Sub-system:
- Design by:
- Sheet title:
- Sheet:
- of
- Checked by:
- Approved by:
- Doc no:
- Revision
- Size:
- Date:

### Library data of the parts
C164 C165 = _CAP_C_2: CAP
H1 H2 = ESQ-126-14-G-D: CONN SOCKET 52POS 0.1 GOLD PCB; MF: Samtec; MP: ESQ-126-14-G-D; Price: None; Package: None; Value: *; Availability: Unavailable
R229 R230 R231#2 R232#2 R233-R244 R246 R277#2 R278#2 R304 R305 R307 R311 R312 R329 R330 = _RES_B_2: RES

## Sheet 23_MOUNTING_HOLE.SchDoc
size 420 x 297 mm; SheetNumber: 23; SheetTotal: 23
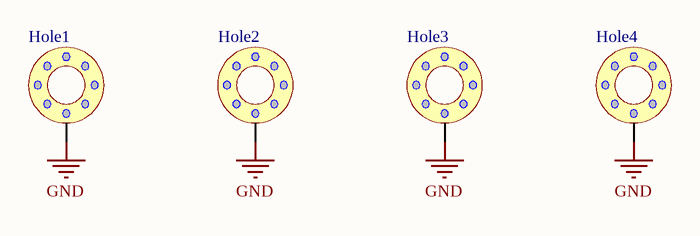
[diagram p30: 23_MOUNTING_HOLE.SchDoc]

### Parts
Hole1  hole_space  [HEX-M3_NoVia]  (value not drawn)
Hole2  hole_space  [HEX-M3_NoVia]  (value not drawn)
Hole3  hole_space  [HEX-M3_NoVia]  (value not drawn)
Hole4  hole_space  [HEX-M3_NoVia]  (value not drawn)

### Nets
GND: Hole1.1 Hole2.1 Hole3.1 Hole4.1

### Notes on the sheet
- Project
- Sub-system:
- Design by:
- Sheet title:
- Sheet:
- of
- Checked by:
- Approved by:
- Doc no:
- Revision
- Size:
- Date:

## Nets that join several sheets
3.3V_COM: 04_POWER (5 pins), 09_CAN (C13.1 C14.1 U3.3), 12_RS485_R232 (5 pins)
3.3V_MCU: 04_POWER (5 pins), 06_POWER_MEASUREMENT (11 pins), 08_MCU (22 pins), 10_PRAM_RTC_WDT (19 pins), 11_CONSOLE (C18.2 J1.1 R23.2 R24.2), 13_FLOW_Sensor (14 pins), 14_I2C_Sensor_OnBoard (17 pins), 15_HD_PUMP (8 pins), 16_SOLENOID_HB_1 (6 pins), 17_CAM_CONNECTOR (18 pins), NTC (8 pins), 22_CONNECTOR_INTERFACE (5 pins)
3.3V_MOTOR: 04_POWER (5 pins), LIMIT_SENSORS (8 pins), HALF_BRIDGE_DRIVER (C82#1.2 C83#1.2 R180#1.2 U20#1.6)
5V_EXP: 04_POWER (C113.1 C116.1 VR1.3 VR2.3), 05_POWER_EFUSE (D11.2 R1.1), 06_POWER_MEASUREMENT (R253.2), 07_FUNCTION_EFUSE (7 pins), 22_CONNECTOR_INTERFACE (C164.2 R237.2 R238.2 U32.8)
5V_MOTOR: 04_POWER (6 pins), LIMIT_SENSORS (J16#1.1 J16#1.5 J20.1 J20.5), HALF_BRIDGE_DRIVER (JP5.3)
5V_SLN_HD: 06_POWER_MEASUREMENT (R254.2), 07_FUNCTION_EFUSE (D15.2), 15_HD_PUMP (19 pins), 16_SOLENOID_HB_1 (24 pins)
5V_SLN_HD_eFuse: 06_POWER_MEASUREMENT (R254.1), 07_FUNCTION_EFUSE (7 pins)
12V_EXP: 05_POWER_EFUSE (D10.2), 06_POWER_MEASUREMENT (R252.2), 18_IR_LED (10 pins), HEATER (9 pins)
12V_MOTOR: 04_POWER (C20#1.2 U33.7), 06_POWER_MEASUREMENT (R255.2), 07_FUNCTION_EFUSE (D16.2), HALF_BRIDGE_DRIVER (JP5.2)
12V_MOTOR_eFuse: 06_POWER_MEASUREMENT (R255.1), 07_FUNCTION_EFUSE (7 pins)
BUS_5V: 05_POWER_EFUSE (5 pins), 22_CONNECTOR_INTERFACE (H2.25 H2.26)
efuse_BUS_5V: 05_POWER_EFUSE (7 pins), 06_POWER_MEASUREMENT (R253.1)
efuse_STX_12V: 05_POWER_EFUSE (7 pins), 06_POWER_MEASUREMENT (R252.1)
GND: 04_POWER (22 pins), 05_POWER_EFUSE (23 pins), 06_POWER_MEASUREMENT (6 pins), 07_FUNCTION_EFUSE (24 pins), 08_MCU (36 pins), 09_CAN (5 pins), 10_PRAM_RTC_WDT (14 pins), 11_CONSOLE (C18.1 J1.4 J1.M1 J1.M2), 12_RS485_R232 (8 pins), 13_FLOW_Sensor (12 pins), 14_I2C_Sensor_OnBoard (12 pins), 15_HD_PUMP (26 pins), 16_SOLENOID_HB_1 (20 pins), 17_CAM_CONNECTOR (14 pins), 18_IR_LED (18 pins), HEATER (11 pins), NTC (18 pins), LIMIT_SENSORS (8 pins), HALF_BRIDGE_DRIVER (24 pins), 22_CONNECTOR_INTERFACE (10 pins), 23_MOUNTING_HOLE (Hole1.1 Hole2.1 Hole3.1 Hole4.1)
STX_12V: 05_POWER_EFUSE (5 pins), 07_FUNCTION_EFUSE (5 pins), 22_CONNECTOR_INTERFACE (H2.23 H2.24)
ADC_TEMP1: 08_MCU (R58.2), NTC (C174.2 R347.2)
ADC_TEMP2: 08_MCU (R60.2), NTC (C172.2 R344.2)
ADC_TEMP3: 08_MCU (R335.2), NTC (C177.2 R350.2)
ADC_TEMP4: 08_MCU (R334.1), NTC (C179.2 R353.2)
CAN_H: 09_CAN (JP6.2 U3.7), 22_CONNECTOR_INTERFACE (H1.03)
CAN_L: 09_CAN (JP7.1 U3.6), 22_CONNECTOR_INTERFACE (H1.01)
CANRX1: 08_MCU (R93.2), 09_CAN (U3.4)
CANTX1: 08_MCU (R98.2), 09_CAN (U3.1)
HEATER_PWM_1: 08_MCU (R71.2), HEATER (R336.1)
HEATER_PWM_2: 08_MCU (R27.2), HEATER (R341.1)
HEATER_PWM_3: 08_MCU (R29.2), HEATER (R337.1)
HEATER_PWM_4: 08_MCU (R69.2), HEATER (R340.1)
LSM6DSOX_INT: 08_MCU (R106.2), 14_I2C_Sensor_OnBoard (R149#2.2 U14#2.9)
MCU_CAM1_EN: 08_MCU (R82.2), 17_CAM_CONNECTOR (R287.1)
MCU_CAM2_EN: 08_MCU (R103.2), 17_CAM_CONNECTOR (R298.1)
MCU_CONSOLE_RX: 08_MCU (R68.1), 11_CONSOLE (R24.1 R26.2)
MCU_CONSOLE_TX: 08_MCU (R70.1), 11_CONSOLE (R23.1 R25.2)
MCU_FRAM_nCS: 08_MCU (R59.2), 10_PRAM_RTC_WDT (R114.1 U6.1)
MCU_HD4_I2C_EN: 08_MCU (R102.2), 15_HD_PUMP (R163.1 U16.5)
MCU_HD_I2C_EN: 08_MCU (R73.2), 15_HD_PUMP (R332.1 U12.5)
MCU_I2C0_SCL: 06_POWER_MEASUREMENT (R247.2 U25.4), 08_MCU (R36.2), 13_FLOW_Sensor (R127.2 U9.2 U10.2), 15_HD_PUMP (R136.2 R157.2 R161.1 R321.1)
MCU_I2C0_SDA: 06_POWER_MEASUREMENT (R248.2 U25.5), 08_MCU (R33.2), 13_FLOW_Sensor (R126.2 U9.3 U10.3), 15_HD_PUMP (R137.2 R158.2 R162.1 R331.1)
MCU_I2C1_SCL: 08_MCU (R97.1), 10_PRAM_RTC_WDT (R119.1 U7.4), 14_I2C_Sensor_OnBoard (R143.1 R150#2.1), 17_CAM_CONNECTOR (R285.1 R296.1)
MCU_I2C1_SDA: 08_MCU (R92.1), 10_PRAM_RTC_WDT (R120.1 U7.5), 14_I2C_Sensor_OnBoard (R142.2 R151#2.1), 17_CAM_CONNECTOR (R286.1 R297.1)
MCU_IR_LED_1_PWM: 08_MCU (R79.2), 18_IR_LED (R174.2 R175.1)
MCU_IR_LED_2_PWM: 08_MCU (R303.2), 18_IR_LED (R177.2 R178.1)
MCU_PC104_I2C2_SCL: 08_MCU (R74.1), 17_CAM_CONNECTOR (R289.1 R316.1), 22_CONNECTOR_INTERFACE (R330.1 U32.3)
MCU_PC104_I2C2_SDA: 08_MCU (R72.1), 17_CAM_CONNECTOR (R302.1 R317.1), 22_CONNECTOR_INTERFACE (R329.1 U32.2)
MCU_PC104_SPI0_CS1: 08_MCU (R326.1), 22_CONNECTOR_INTERFACE (R233.1)
MCU_PC104_SPI0_CS2: 08_MCU (R325.2), 22_CONNECTOR_INTERFACE (R311.1)
MCU_PC104_SPI0_IRQ1: 08_MCU (R309.2), 22_CONNECTOR_INTERFACE (R307.2)
MCU_PC104_SPI0_IRQ2: 08_MCU (R310.2), 22_CONNECTOR_INTERFACE (R312.2)
MCU_PC104_SPI0_MISO: 08_MCU (R109.1), 22_CONNECTOR_INTERFACE (R236.1)
MCU_PC104_SPI0_MOSI: 08_MCU (R323.1), 22_CONNECTOR_INTERFACE (R235.1)
MCU_PC104_SPI0_SCK: 08_MCU (R324.2), 22_CONNECTOR_INTERFACE (R234.1)
MCU_PRAM_SPI1_nCS: 08_MCU (R308.2), 10_PRAM_RTC_WDT (U28#1.1)
MCU_RS232_RX_OBC_TX: 12_RS485_R232 (U4.13), 22_CONNECTOR_INTERFACE (R242.1)
MCU_RS232_TX_OBC_RX: 12_RS485_R232 (U4.14), 22_CONNECTOR_INTERFACE (R241.1)
MCU_RS485_~{RE}_DE: 08_MCU (R313.2), 12_RS485_R232 (R275#2.2 U34.2 U34.3)
MCU_RTC_CLKOUT: 08_MCU (R86.2), 10_PRAM_RTC_WDT (R117.1 U7.3)
MCU_RTC_INT: 08_MCU (R87.2), 10_PRAM_RTC_WDT (R118.1 U7.7)
MCU_SENSOR1_nIRQ: 08_MCU (R64.1), 13_FLOW_Sensor (J4.1)
MCU_SENSOR2_nIRQ: 08_MCU (R66.1), 13_FLOW_Sensor (J5.1)
MCU_SPI0_CMD_SOLE_A: 08_MCU (R105.2), 16_SOLENOID_HB_1 (R171.1)
MCU_SPI0_CMD_SOLE_B: 08_MCU (R76.1), 16_SOLENOID_HB_1 (R416.1)
MCU_SPI0_nCS_SOLE_A: 08_MCU (R104.1), 16_SOLENOID_HB_1 (R167.1)
MCU_SPI0_nCS_SOLE_B: 08_MCU (R75.1), 16_SOLENOID_HB_1 (R412.1)
MCU_SPI1_MISO: 08_MCU (R108.2 R110.2), 10_PRAM_RTC_WDT (U28#1.2), HALF_BRIDGE_DRIVER (U20#1.7)
MCU_SPI1_MOSI: 08_MCU (R111.2), 10_PRAM_RTC_WDT (U28#1.5), HALF_BRIDGE_DRIVER (U20#1.5)
MCU_SPI1_SCK: 08_MCU (R107.2), 10_PRAM_RTC_WDT (U28#1.6), HALF_BRIDGE_DRIVER (U20#1.20)
MCU_STEP_FAULT: 08_MCU (R77#1.2), HALF_BRIDGE_DRIVER (R180#1.1 U20#1.12)
MCU_STEP_SLEEP: 08_MCU (R30.2), HALF_BRIDGE_DRIVER (U20#1.8)
MCU_STEP_SPI1_nCS: 08_MCU (R179#1.2), HALF_BRIDGE_DRIVER (U20#1.19)
MCU_UART0_RX_OBC_TX: 08_MCU (R46.2), 12_RS485_R232 (U4.12)
MCU_UART0_TX_OBC_RX: 08_MCU (R48.2), 12_RS485_R232 (U4.11)
MCU_UART4_RX: 08_MCU (R57.1), 12_RS485_R232 (U34.1)
MCU_UART4_TX: 08_MCU (R34.1), 12_RS485_R232 (U34.4)
MCU_USART_RXD2: 08_MCU (R54.1), 10_PRAM_RTC_WDT (U6.2), 16_SOLENOID_HB_1 (R165.2 R166.1 R410.2 R411.1)
MCU_USART_SCK2: 08_MCU (R56.1), 10_PRAM_RTC_WDT (U6.6), 16_SOLENOID_HB_1 (R168.1 R413.1)
MCU_USART_TXD2: 08_MCU (R55.1), 10_PRAM_RTC_WDT (U6.5), 16_SOLENOID_HB_1 (R169.1 R414.1)
MCU_WD_DONE: 08_MCU (R83.1), 10_PRAM_RTC_WDT (U8.4)
MCU_WD_nRESET: 08_MCU (R80.2), 10_PRAM_RTC_WDT (R123.1)
MCU_WD_WAKE: 08_MCU (R85.1), 10_PRAM_RTC_WDT (U8.5)
NetR61_2: 06_POWER_MEASUREMENT (R250.2 U25.1), 08_MCU (R61.2)
PC104_CAM1_EN: 17_CAM_CONNECTOR (R315.1), 22_CONNECTOR_INTERFACE (R304.1)
PC104_CAM2_EN: 17_CAM_CONNECTOR (R318.1), 22_CONNECTOR_INTERFACE (R305.1)
PC104_I2C_IRQ1: 08_MCU (R101.2), 22_CONNECTOR_INTERFACE (R243.1)
PM-L25_1_DARK_ON: 08_MCU (R44.2), LIMIT_SENSORS (J20.3 R63.1)
PM-L25_1_LIGHT_ON: 08_MCU (R42.2), LIMIT_SENSORS (J20.2 R62.1)
PM-L25_2_DARK_ON: 08_MCU (R40.1), LIMIT_SENSORS (J20.7 R67.1)
PM-L25_2_LIGHT_ON: 08_MCU (R39.1), LIMIT_SENSORS (J20.6 R65.1)
PM-U25_1_DARK_ON: 08_MCU (R22.1), LIMIT_SENSORS (J16#1.3 R51.1)
PM-U25_1_LIGHT_ON: 08_MCU (R38.1), LIMIT_SENSORS (J16#1.2 R50.1)
PM-U25_2_DARK_ON: 08_MCU (R49.2), LIMIT_SENSORS (J16#1.7 R53.1)
PM-U25_2_LIGHT_ON: 08_MCU (R47.2), LIMIT_SENSORS (J16#1.6 R52.1)
POW_ONOFF_MOTOR: 07_FUNCTION_EFUSE (R267.2 R272.1 U27.1), 08_MCU (R37.1)
POW_ONOFF_SLN_HD: 07_FUNCTION_EFUSE (R259.2 R264.1 U26.1), 08_MCU (R32.1)
POW_ONOFF_STX_12V: 05_POWER_EFUSE (R1.2 R6.1 U1.1), 08_MCU (R28.1)
RS_485_N: 12_RS485_R232 (R276#2.1 U34.7), 22_CONNECTOR_INTERFACE (R239.1)
RS_485_P: 12_RS485_R232 (R276#2.2 U34.6), 22_CONNECTOR_INTERFACE (R240.2)
SENSOR1_EN: 08_MCU (R88.2), 13_FLOW_Sensor (R130.1 U9.5)
SENSOR2_EN: 08_MCU (R90.2), 13_FLOW_Sensor (R133.1 U10.5)
TEMP _SENSOR: 08_MCU (R306.1), 14_I2C_Sensor_OnBoard (U31.2)